# EAGLE schematic main (EAGLE 8.0.0), part 2 of 4
## Sheet 21 of 48: CLA_MULT 10-7
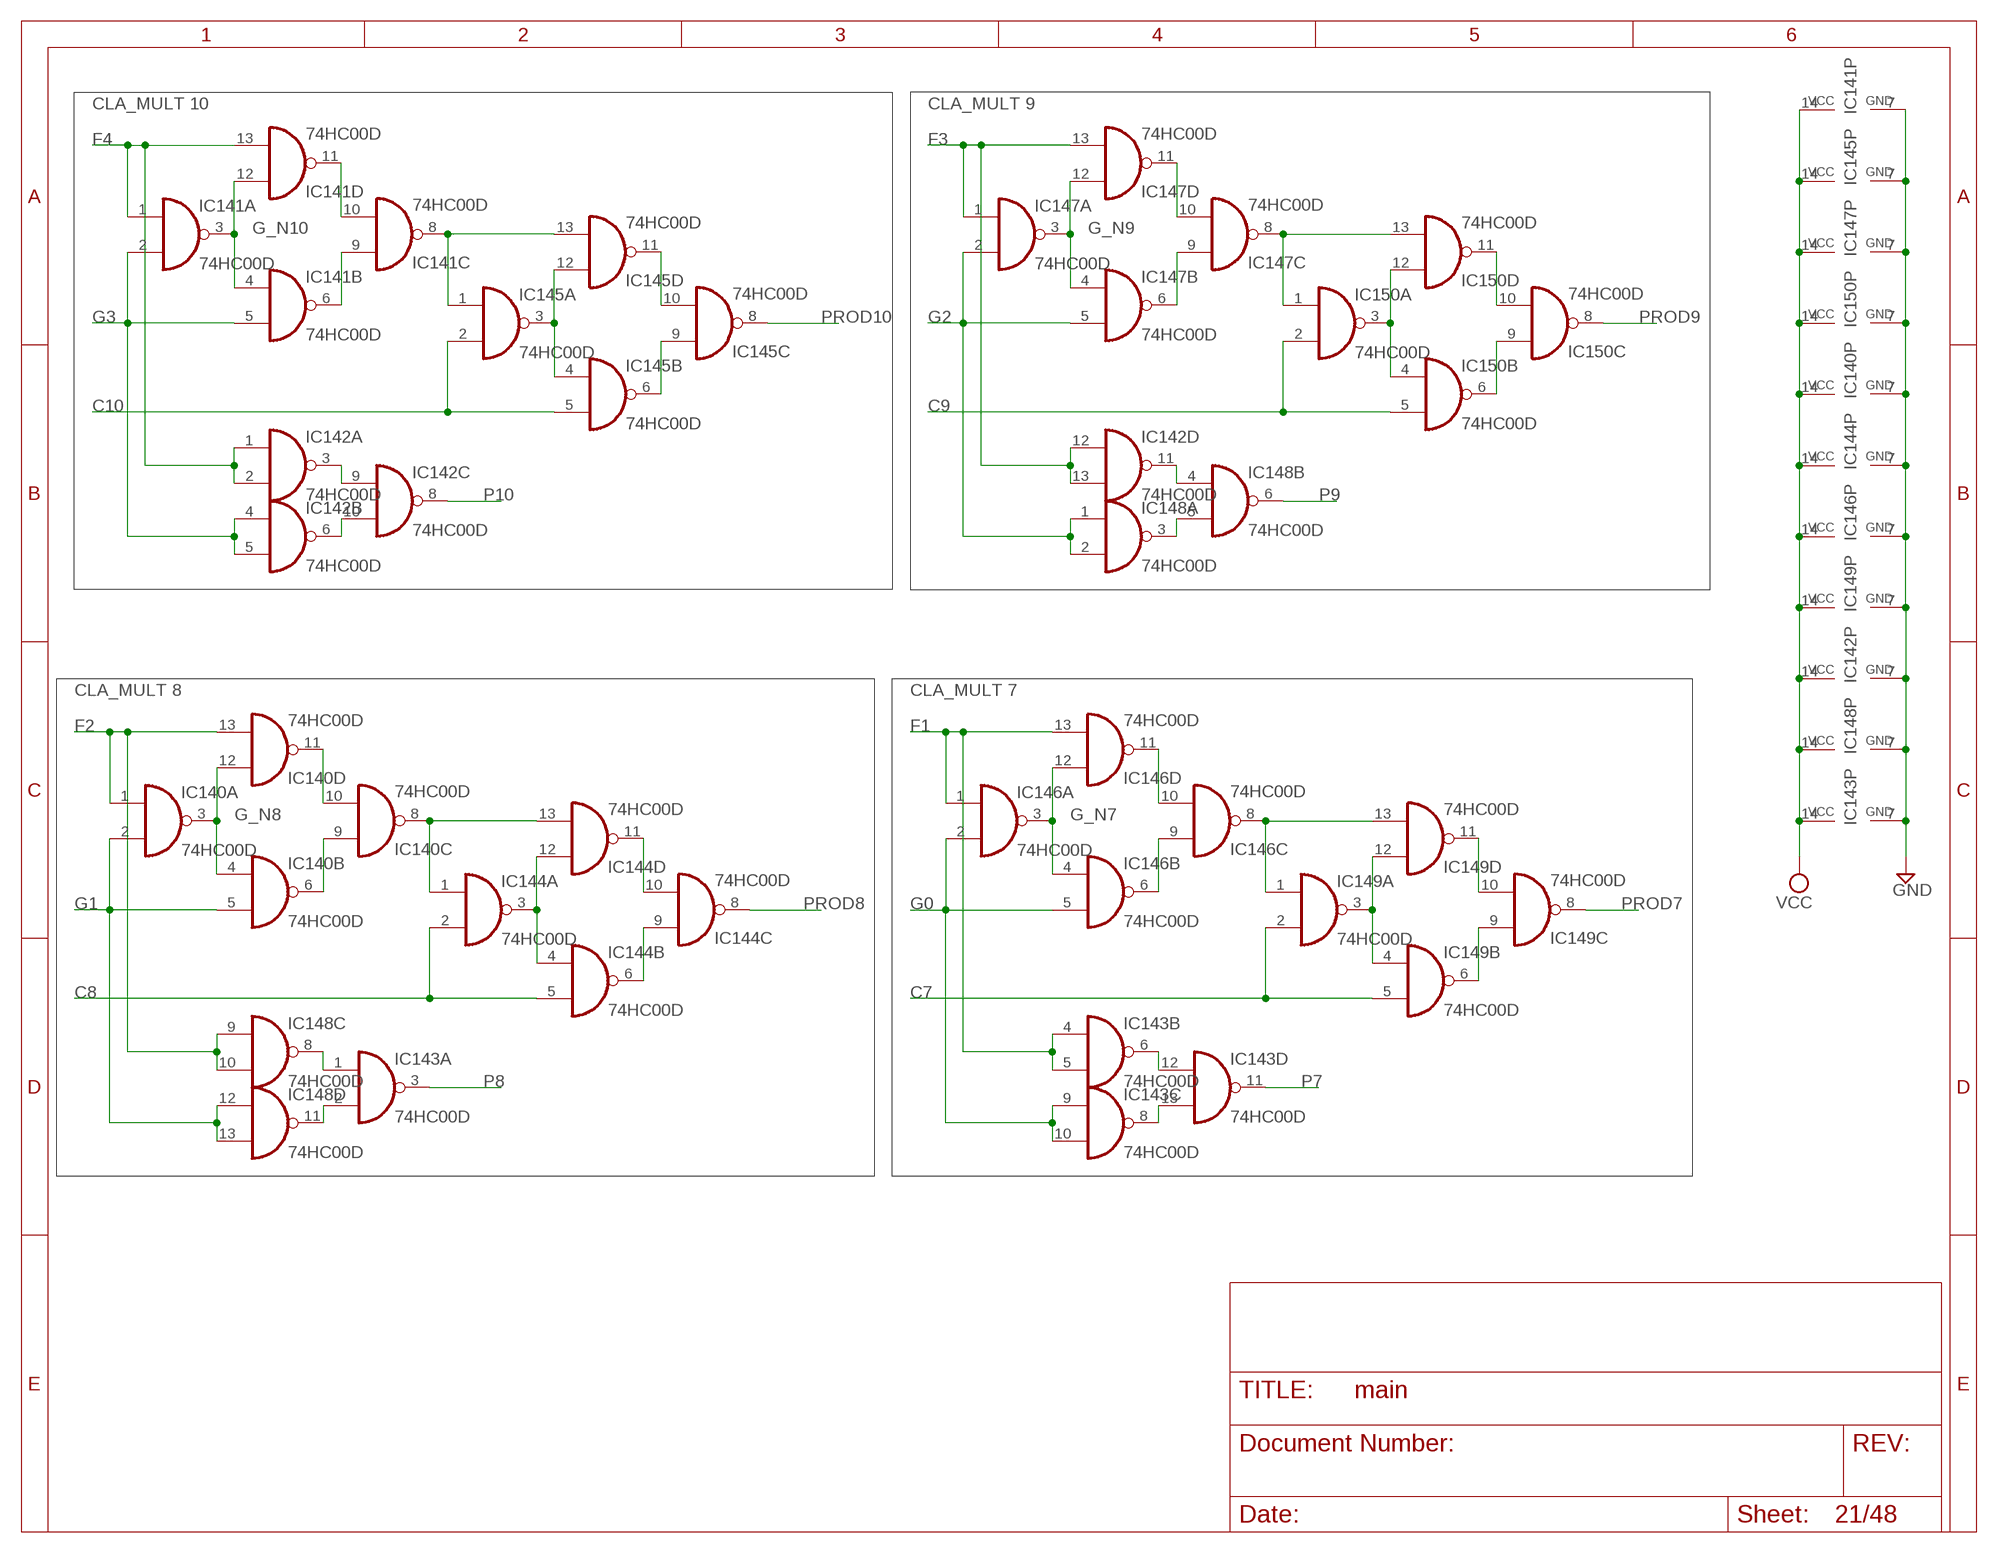
[diagram p20: schematic, sheet 21]

### Parts
IC140  74HC00D  [SO14]
IC141  74HC00D  [SO14]
IC142  74HC00D  [SO14]
IC143  74HC00D  [SO14]
IC144  74HC00D  [SO14]
IC145  74HC00D  [SO14]
IC146  74HC00D  [SO14]
IC147  74HC00D  [SO14]
IC148  74HC00D  [SO14]
IC149  74HC00D  [SO14]
IC150  74HC00D  [SO14]

### Nets
C7: IC149.2(A:I1) IC149.5(B:I1) ; also sheet 23
C8: IC144.2(A:I1) IC144.5(B:I1) ; also sheet 23
C9: IC150.2(A:I1) IC150.5(B:I1) ; also sheet 23
C10: IC145.2(A:I1) IC145.5(B:I1) ; also sheet 23
F1: IC143.4(B:I0) IC143.5(B:I1) IC146.1(A:I0) IC146.13(D:I1) ; also sheet 18
F2: IC140.1(A:I0) IC140.13(D:I1) IC148.9(C:I0) IC148.10(C:I1) ; also sheet 18
F3: IC142.12(D:I0) IC142.13(D:I1) IC147.1(A:I0) IC147.13(D:I1) ; also sheet 18
F4: IC141.1(A:I0) IC141.13(D:I1) IC142.1(A:I0) IC142.2(A:I1) ; also sheet 18
G0: IC143.9(C:I0) IC143.10(C:I1) IC146.2(A:I1) IC146.5(B:I1) ; also sheet 14
G1: IC140.2(A:I1) IC140.5(B:I1) IC148.12(D:I0) IC148.13(D:I1) ; also sheet 18
G2: IC147.2(A:I1) IC147.5(B:I1) IC148.1(A:I0) IC148.2(A:I1) ; also sheet 18
G3: IC141.2(A:I1) IC141.5(B:I1) IC142.4(B:I0) IC142.5(B:I1) ; also sheet 18
G_N7: IC146.3(A:O) IC146.4(B:I0) IC146.12(D:I0) ; also sheet 23
G_N8: IC140.3(A:O) IC140.4(B:I0) IC140.12(D:I0) ; also sheet 23
G_N9: IC147.3(A:O) IC147.4(B:I0) IC147.12(D:I0) ; also sheet 23
G_N10: IC141.3(A:O) IC141.4(B:I0) IC141.12(D:I0) ; also sheet 23
GND: IC140.7(P:GND) IC141.7(P:GND) IC142.7(P:GND) IC143.7(P:GND) IC144.7(P:GND) IC145.7(P:GND) IC146.7(P:GND) IC147.7(P:GND) IC148.7(P:GND) IC149.7(P:GND) IC150.7(P:GND) ; also sheet 1,2,3,4,5,6,7,8,9,10,11,12,13,14,15,16,17,18,19,20,22,23,24,25,26,27,28,29,30,31,32,33,34,37,38,39,40,41,42,43,44,45,46,47
N$387: IC145.6(B:O) IC145.9(C:I0)
N$388: IC145.10(C:I1) IC145.11(D:O)
N$391: IC145.3(A:O) IC145.4(B:I0) IC145.12(D:I0)
N$392: IC141.6(B:O) IC141.9(C:I0)
N$411: IC141.10(C:I1) IC141.11(D:O)
N$415: IC141.8(C:O) IC145.1(A:I0) IC145.13(D:I1)
N$416: IC147.10(C:I1) IC147.11(D:O)
N$417: IC147.6(B:O) IC147.9(C:I0)
N$418: IC147.8(C:O) IC150.1(A:I0) IC150.13(D:I1)
N$423: IC150.3(A:O) IC150.4(B:I0) IC150.12(D:I0)
N$426: IC150.6(B:O) IC150.9(C:I0)
N$427: IC150.10(C:I1) IC150.11(D:O)
N$428: IC144.3(A:O) IC144.4(B:I0) IC144.12(D:I0)
N$430: IC140.8(C:O) IC144.1(A:I0) IC144.13(D:I1)
N$436: IC144.10(C:I1) IC144.11(D:O)
N$437: IC144.6(B:O) IC144.9(C:I0)
N$438: IC140.10(C:I1) IC140.11(D:O)
N$439: IC140.6(B:O) IC140.9(C:I0)
N$442: IC146.6(B:O) IC146.9(C:I0)
N$443: IC146.10(C:I1) IC146.11(D:O)
N$447: IC146.8(C:O) IC149.1(A:I0) IC149.13(D:I1)
N$450: IC149.3(A:O) IC149.4(B:I0) IC149.12(D:I0)
N$451: IC149.6(B:O) IC149.9(C:I0)
N$452: IC149.10(C:I1) IC149.11(D:O)
N$454: IC142.3(A:O) IC142.9(C:I0)
N$455: IC142.6(B:O) IC142.10(C:I1)
N$456: IC148.3(A:O) IC148.5(B:I1)
N$459: IC142.11(D:O) IC148.4(B:I0)
N$460: IC143.2(A:I1) IC148.11(D:O)
N$463: IC143.1(A:I0) IC148.8(C:O)
N$464: IC143.8(C:O) IC143.13(D:I1)
N$465: IC143.6(B:O) IC143.12(D:I0)
P7: IC143.11(D:O) ; also sheet 23
P8: IC143.3(A:O) ; also sheet 23
P9: IC148.6(B:O) ; also sheet 23
P10: IC142.8(C:O) ; also sheet 23
PROD7: IC149.8(C:O) ; also sheet 44
PROD8: IC144.8(C:O)
PROD9: IC150.8(C:O)
PROD10: IC145.8(C:O)
VCC: IC140.14(P:VCC) IC141.14(P:VCC) IC142.14(P:VCC) IC143.14(P:VCC) IC144.14(P:VCC) IC145.14(P:VCC) IC146.14(P:VCC) IC147.14(P:VCC) IC148.14(P:VCC) IC149.14(P:VCC) IC150.14(P:VCC) ; also sheet 1,2,3,4,5,6,7,8,9,10,11,12,13,14,15,16,17,18,19,20,22,23,24,25,26,27,28,29,30,31,32,33,34,37,38,39,40,41,42,43,44,45,46,47

### Notes on the sheet
- CLA_MULT 10 | CLA_MULT 9
- CLA_MULT 8 | CLA_MULT 7

## Sheet 22 of 48: CLA_MULT 5-2
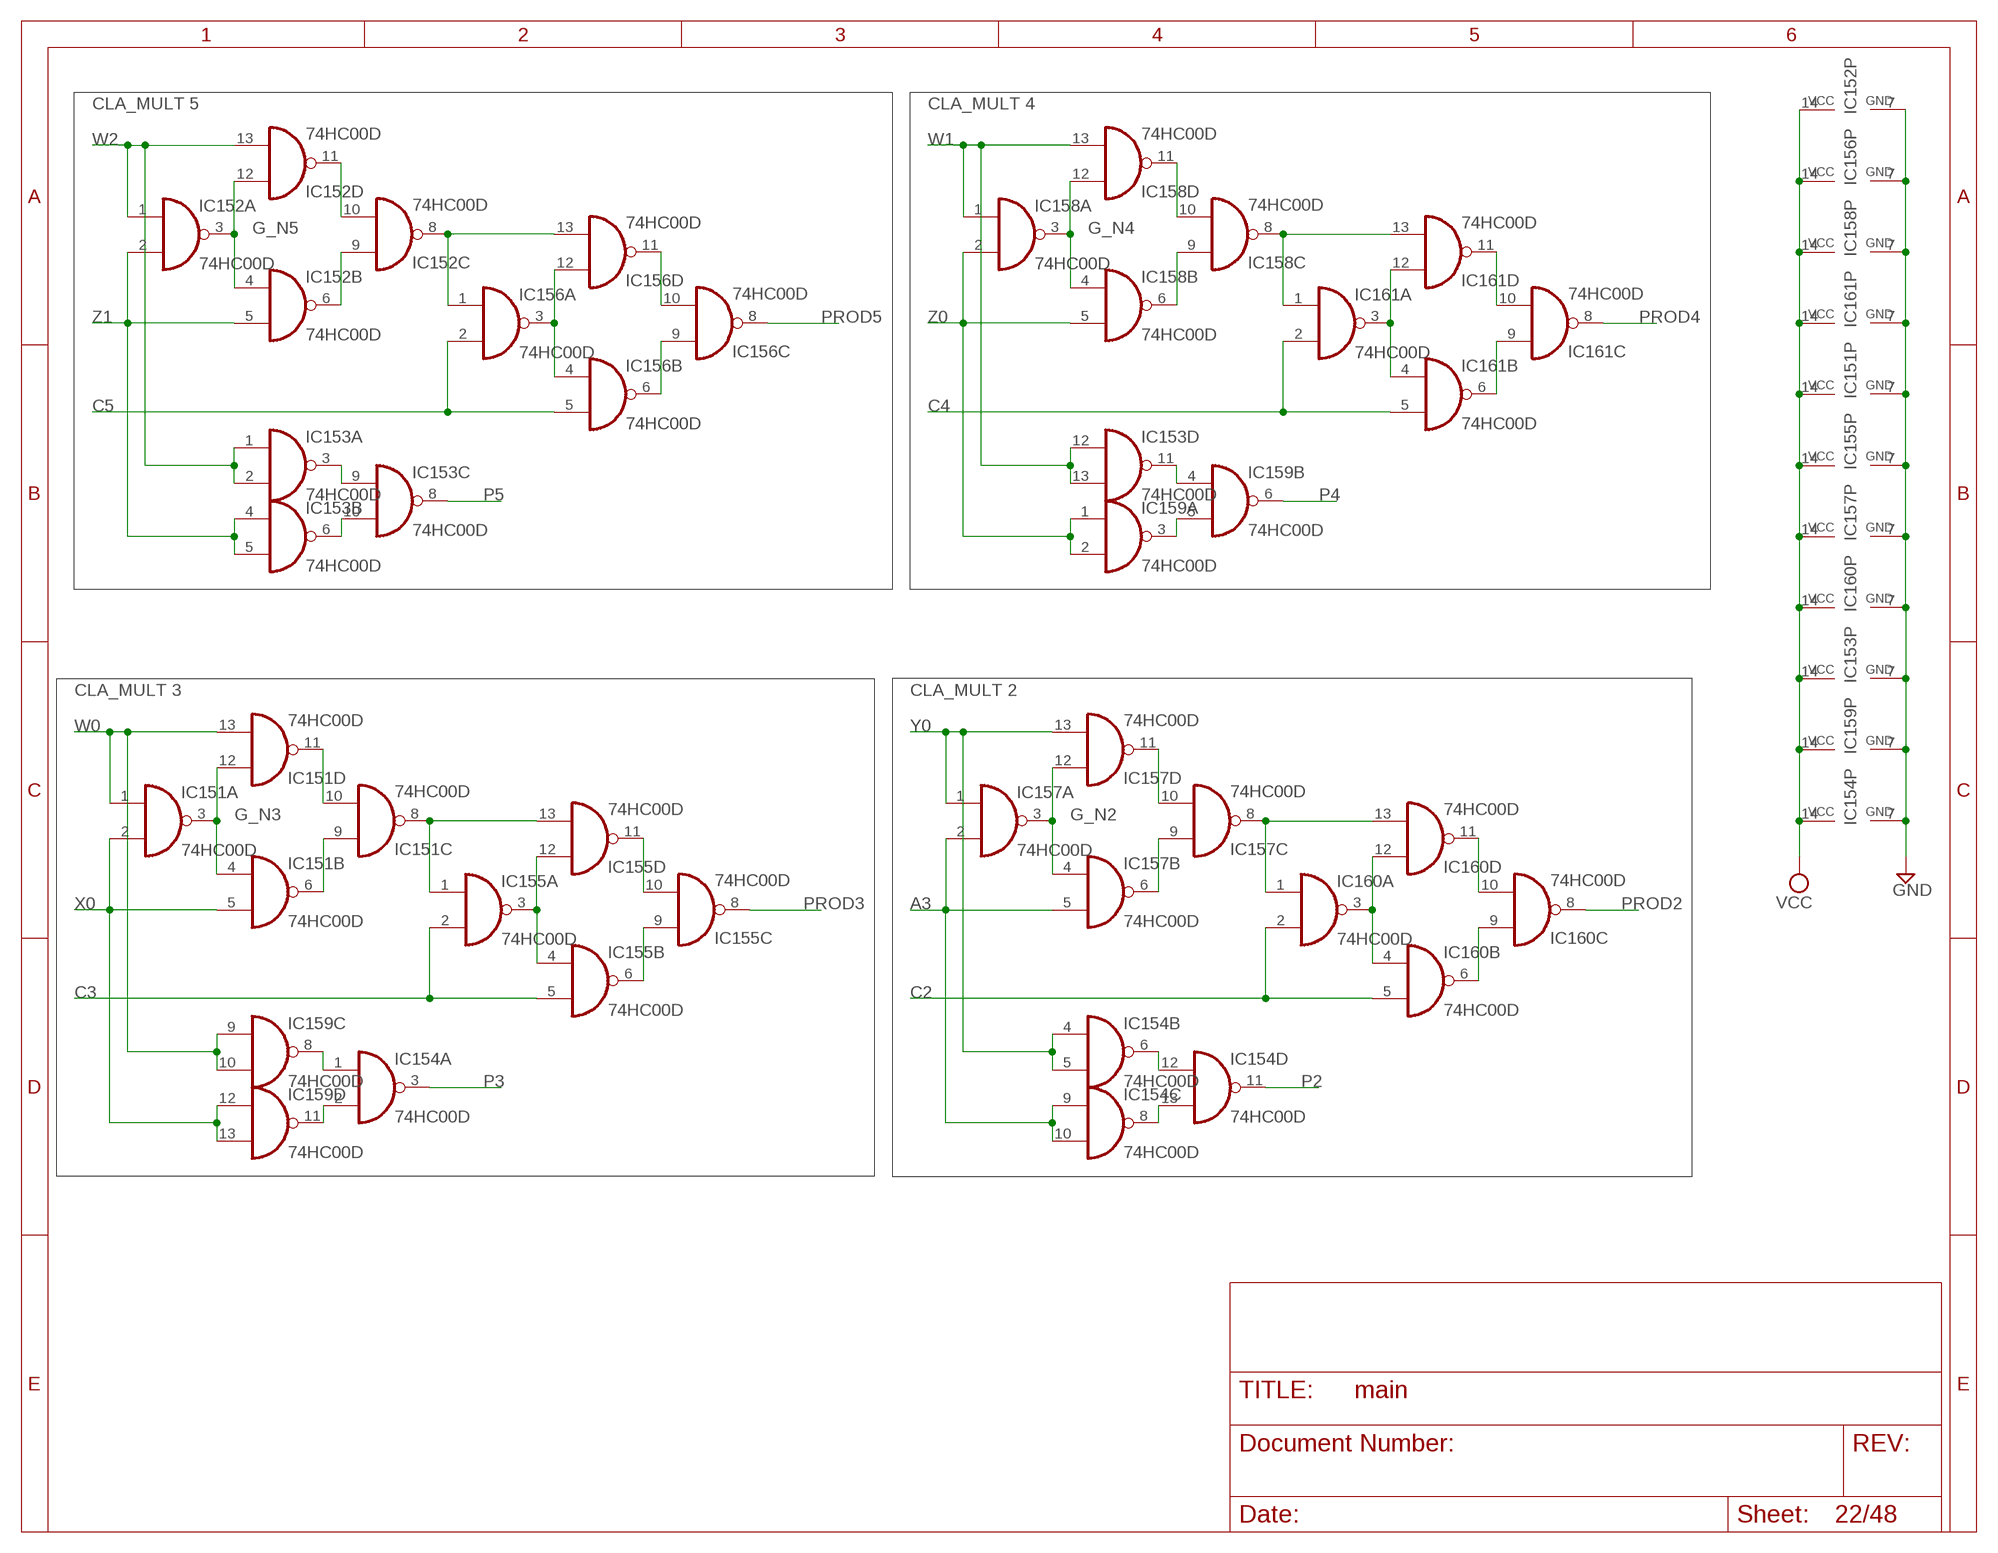
[diagram p21: schematic, sheet 22]

### Parts
IC151  74HC00D  [SO14]
IC152  74HC00D  [SO14]
IC153  74HC00D  [SO14]
IC154  74HC00D  [SO14]
IC155  74HC00D  [SO14]
IC156  74HC00D  [SO14]
IC157  74HC00D  [SO14]
IC158  74HC00D  [SO14]
IC159  74HC00D  [SO14]
IC160  74HC00D  [SO14]
IC161  74HC00D  [SO14]

### Nets
A3: IC154.9(C:I0) IC154.10(C:I1) IC157.2(A:I1) IC157.5(B:I1) ; also sheet 1,2,5,6,11,24,25,26,30,34,41
C2: IC160.2(A:I1) IC160.5(B:I1) ; also sheet 23
C3: IC155.2(A:I1) IC155.5(B:I1) ; also sheet 23
C4: IC161.2(A:I1) IC161.5(B:I1) ; also sheet 23
C5: IC156.2(A:I1) IC156.5(B:I1) ; also sheet 23
G_N2: IC157.3(A:O) IC157.4(B:I0) IC157.12(D:I0) ; also sheet 23
G_N3: IC151.3(A:O) IC151.4(B:I0) IC151.12(D:I0) ; also sheet 23
G_N4: IC158.3(A:O) IC158.4(B:I0) IC158.12(D:I0) ; also sheet 23
G_N5: IC152.3(A:O) IC152.4(B:I0) IC152.12(D:I0) ; also sheet 23
GND: IC151.7(P:GND) IC152.7(P:GND) IC153.7(P:GND) IC154.7(P:GND) IC155.7(P:GND) IC156.7(P:GND) IC157.7(P:GND) IC158.7(P:GND) IC159.7(P:GND) IC160.7(P:GND) IC161.7(P:GND) ; also sheet 1,2,3,4,5,6,7,8,9,10,11,12,13,14,15,16,17,18,19,20,21,23,24,25,26,27,28,29,30,31,32,33,34,37,38,39,40,41,42,43,44,45,46,47
N$466: IC156.6(B:O) IC156.9(C:I0)
N$469: IC156.10(C:I1) IC156.11(D:O)
N$470: IC156.3(A:O) IC156.4(B:I0) IC156.12(D:I0)
N$471: IC152.8(C:O) IC156.1(A:I0) IC156.13(D:I1)
N$472: IC152.6(B:O) IC152.9(C:I0)
N$473: IC152.10(C:I1) IC152.11(D:O)
N$474: IC158.10(C:I1) IC158.11(D:O)
N$475: IC158.6(B:O) IC158.9(C:I0)
N$476: IC158.8(C:O) IC161.1(A:I0) IC161.13(D:I1)
N$477: IC161.3(A:O) IC161.4(B:I0) IC161.12(D:I0)
N$478: IC161.6(B:O) IC161.9(C:I0)
N$479: IC161.10(C:I1) IC161.11(D:O)
N$480: IC155.3(A:O) IC155.4(B:I0) IC155.12(D:I0)
N$481: IC151.8(C:O) IC155.1(A:I0) IC155.13(D:I1)
N$482: IC155.10(C:I1) IC155.11(D:O)
N$483: IC155.6(B:O) IC155.9(C:I0)
N$484: IC151.10(C:I1) IC151.11(D:O)
N$485: IC151.6(B:O) IC151.9(C:I0)
N$486: IC157.6(B:O) IC157.9(C:I0)
N$487: IC157.10(C:I1) IC157.11(D:O)
N$488: IC157.8(C:O) IC160.1(A:I0) IC160.13(D:I1)
N$489: IC160.3(A:O) IC160.4(B:I0) IC160.12(D:I0)
N$490: IC160.6(B:O) IC160.9(C:I0)
N$491: IC160.10(C:I1) IC160.11(D:O)
N$492: IC153.3(A:O) IC153.9(C:I0)
N$493: IC153.6(B:O) IC153.10(C:I1)
N$494: IC159.3(A:O) IC159.5(B:I1)
N$495: IC153.11(D:O) IC159.4(B:I0)
N$496: IC154.2(A:I1) IC159.11(D:O)
N$497: IC154.1(A:I0) IC159.8(C:O)
N$498: IC154.8(C:O) IC154.13(D:I1)
N$499: IC154.6(B:O) IC154.12(D:I0)
P2: IC154.11(D:O) ; also sheet 23
P3: IC154.3(A:O) ; also sheet 23
P4: IC159.6(B:O) ; also sheet 23
P5: IC153.8(C:O) ; also sheet 23
PROD2: IC160.8(C:O) ; also sheet 45
PROD3: IC155.8(C:O) ; also sheet 45
PROD4: IC161.8(C:O) ; also sheet 44
PROD5: IC156.8(C:O) ; also sheet 44
VCC: IC151.14(P:VCC) IC152.14(P:VCC) IC153.14(P:VCC) IC154.14(P:VCC) IC155.14(P:VCC) IC156.14(P:VCC) IC157.14(P:VCC) IC158.14(P:VCC) IC159.14(P:VCC) IC160.14(P:VCC) IC161.14(P:VCC) ; also sheet 1,2,3,4,5,6,7,8,9,10,11,12,13,14,15,16,17,18,19,20,21,23,24,25,26,27,28,29,30,31,32,33,34,37,38,39,40,41,42,43,44,45,46,47
W0: IC151.1(A:I0) IC151.13(D:I1) IC159.9(C:I0) IC159.10(C:I1) ; also sheet 16
W1: IC153.12(D:I0) IC153.13(D:I1) IC158.1(A:I0) IC158.13(D:I1) ; also sheet 16
W2: IC152.1(A:I0) IC152.13(D:I1) IC153.1(A:I0) IC153.2(A:I1) ; also sheet 16
X0: IC151.2(A:I1) IC151.5(B:I1) IC159.12(D:I0) IC159.13(D:I1) ; also sheet 16
Y0: IC154.4(B:I0) IC154.5(B:I1) IC157.1(A:I0) IC157.13(D:I1) ; also sheet 16
Z0: IC158.2(A:I1) IC158.5(B:I1) IC159.1(A:I0) IC159.2(A:I1) ; also sheet 16
Z1: IC152.2(A:I1) IC152.5(B:I1) IC153.4(B:I0) IC153.5(B:I1) ; also sheet 16

### Notes on the sheet
- CLA_MULT 5 | CLA_MULT 4
- CLA_MULT 3 | CLA_MULT 2

## Sheet 23 of 48: CLA_MULT 15, CLU_MULT
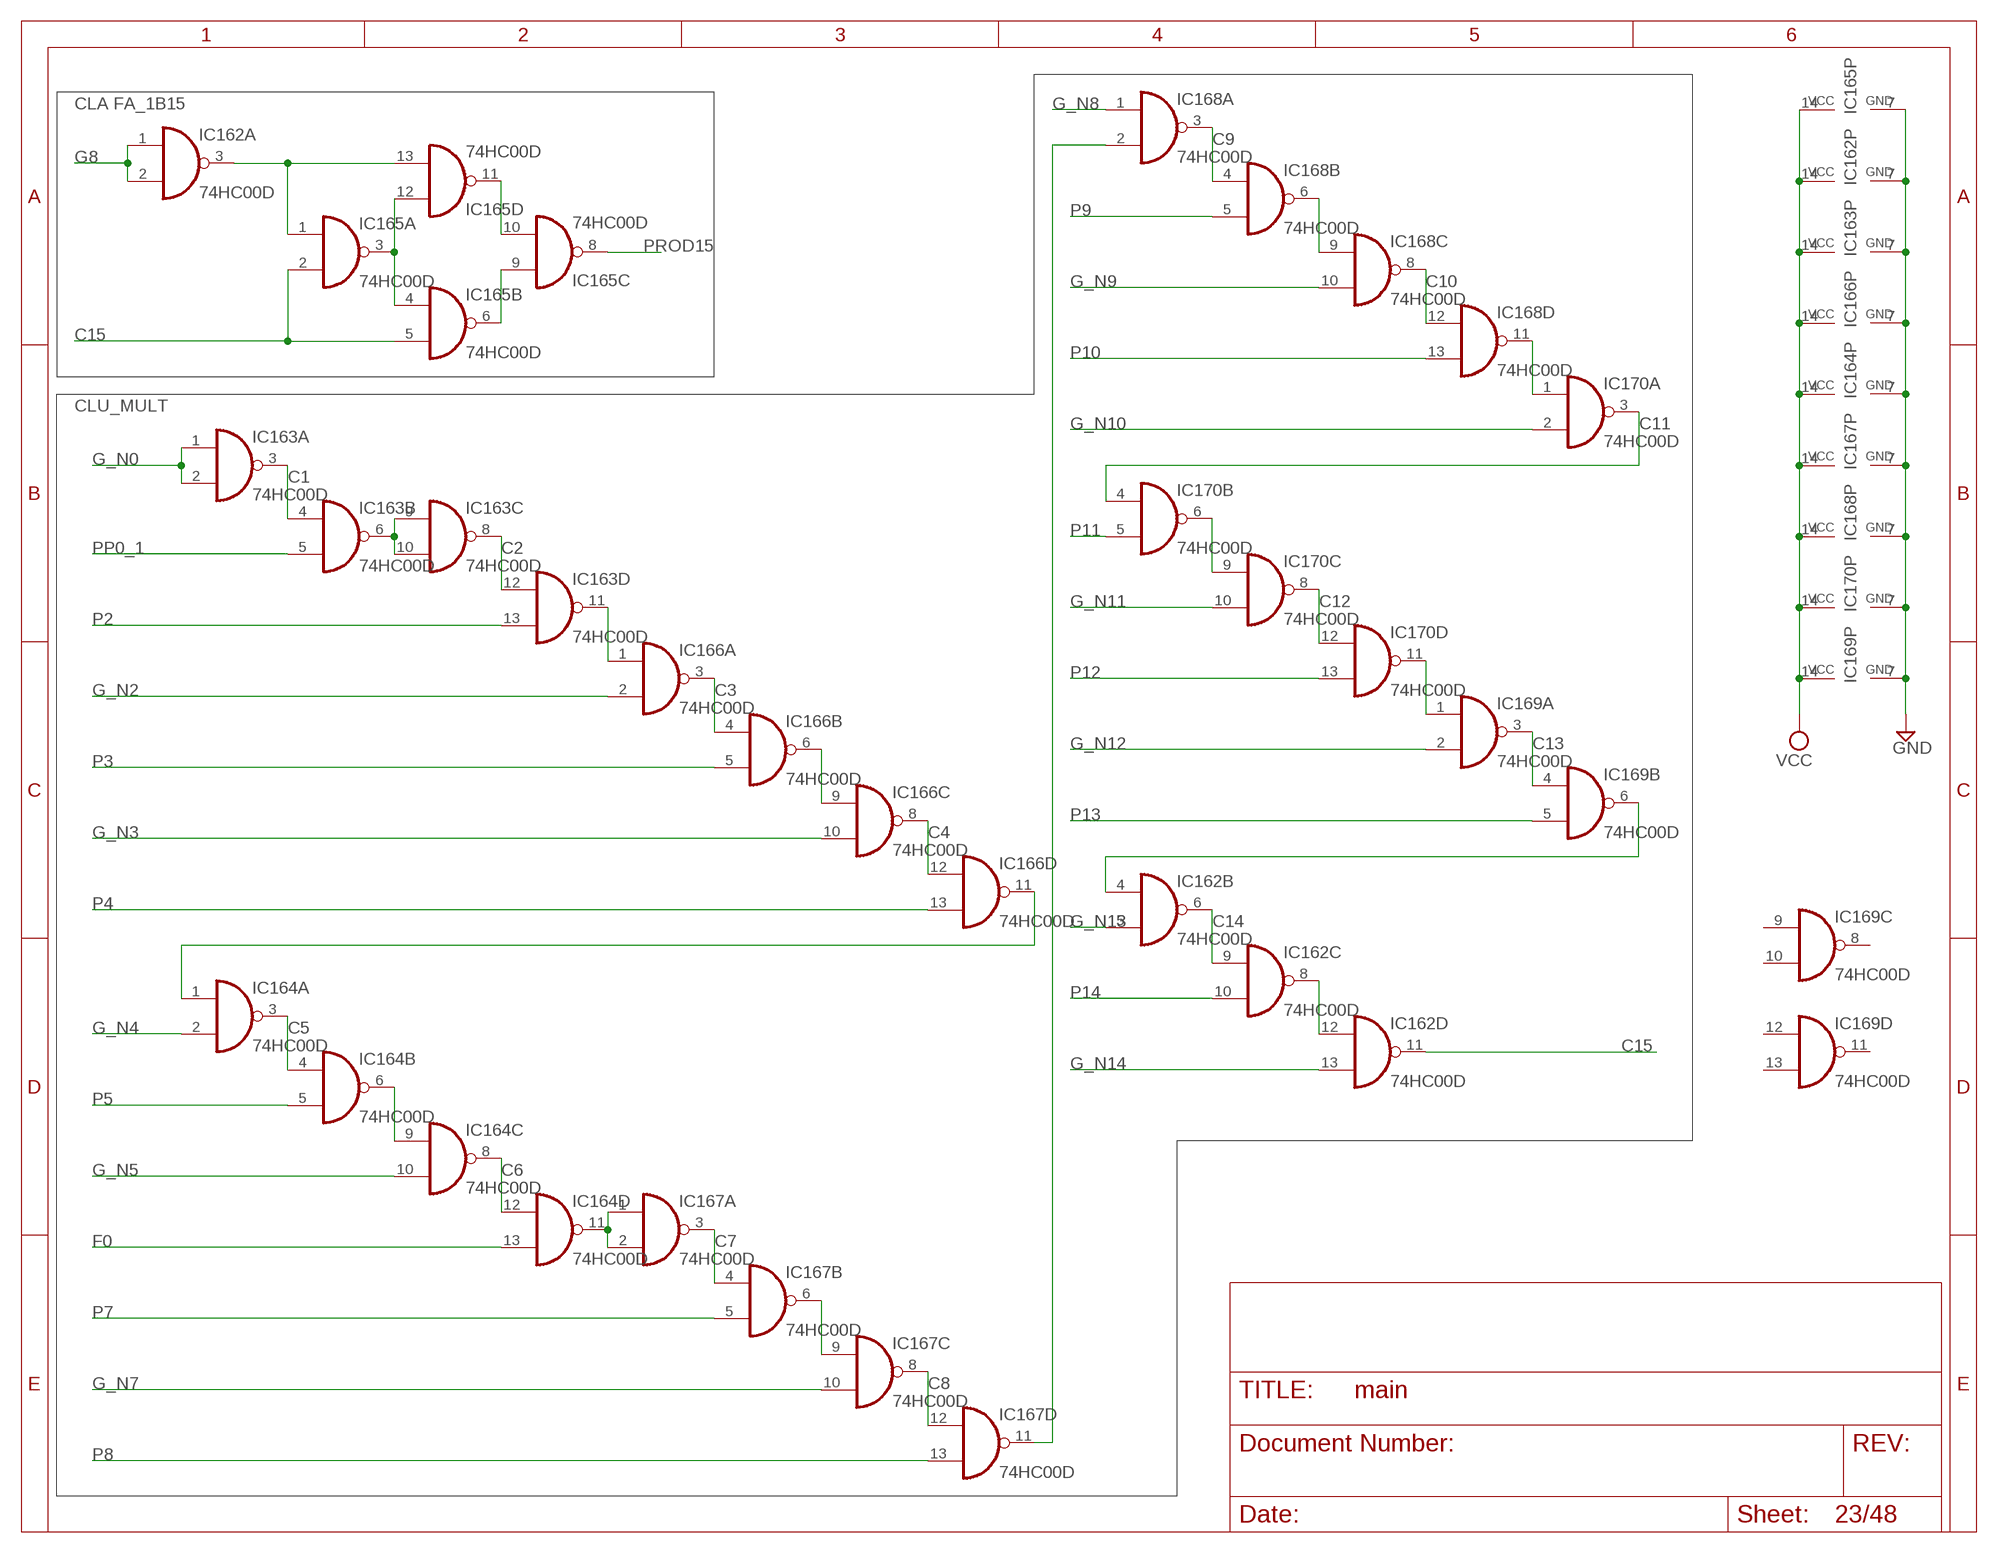
[diagram p22: schematic, sheet 23]

### Parts
IC162  74HC00D  [SO14]
IC163  74HC00D  [SO14]
IC164  74HC00D  [SO14]
IC165  74HC00D  [SO14]
IC166  74HC00D  [SO14]
IC167  74HC00D  [SO14]
IC168  74HC00D  [SO14]
IC169  74HC00D  [SO14]
IC170  74HC00D  [SO14]

### Nets
C1: IC163.3(A:O) IC163.4(B:I0) ; also sheet 19
C2: IC163.8(C:O) IC163.12(D:I0) ; also sheet 22
C3: IC166.3(A:O) IC166.4(B:I0) ; also sheet 22
C4: IC166.8(C:O) IC166.12(D:I0) ; also sheet 22
C5: IC164.3(A:O) IC164.4(B:I0) ; also sheet 22
C6: IC164.8(C:O) IC164.12(D:I0) ; also sheet 19
C7: IC167.3(A:O) IC167.4(B:I0) ; also sheet 21
C8: IC167.8(C:O) IC167.12(D:I0) ; also sheet 21
C9: IC168.3(A:O) IC168.4(B:I0) ; also sheet 21
C10: IC168.8(C:O) IC168.12(D:I0) ; also sheet 21
C11: IC170.3(A:O) IC170.4(B:I0) ; also sheet 20
C12: IC170.8(C:O) IC170.12(D:I0) ; also sheet 20
C13: IC169.3(A:O) IC169.4(B:I0) ; also sheet 20
C14: IC162.6(B:O) IC162.9(C:I0) ; also sheet 20
C15: IC162.11(D:O) IC165.2(A:I1) IC165.5(B:I1)
F0: IC164.13(D:I1) ; also sheet 14,19
G8: IC162.1(A:I0) IC162.2(A:I1) ; also sheet 17
G_N0: IC163.1(A:I0) IC163.2(A:I1) ; also sheet 19
G_N2: IC166.2(A:I1) ; also sheet 22
G_N3: IC166.10(C:I1) ; also sheet 22
G_N4: IC164.2(A:I1) ; also sheet 22
G_N5: IC164.10(C:I1) ; also sheet 22
G_N7: IC167.10(C:I1) ; also sheet 21
G_N8: IC168.1(A:I0) ; also sheet 21
G_N9: IC168.10(C:I1) ; also sheet 21
G_N10: IC170.2(A:I1) ; also sheet 21
G_N11: IC170.10(C:I1) ; also sheet 20
G_N12: IC169.2(A:I1) ; also sheet 20
G_N13: IC162.5(B:I1) ; also sheet 20
G_N14: IC162.13(D:I1) ; also sheet 20
GND: IC162.7(P:GND) IC163.7(P:GND) IC164.7(P:GND) IC165.7(P:GND) IC166.7(P:GND) IC167.7(P:GND) IC168.7(P:GND) IC169.7(P:GND) IC170.7(P:GND) ; also sheet 1,2,3,4,5,6,7,8,9,10,11,12,13,14,15,16,17,18,19,20,21,22,24,25,26,27,28,29,30,31,32,33,34,37,38,39,40,41,42,43,44,45,46,47
N$500: IC162.3(A:O) IC165.1(A:I0) IC165.13(D:I1)
N$501: IC165.3(A:O) IC165.4(B:I0) IC165.12(D:I0)
N$502: IC164.1(A:I0) IC166.11(D:O)
N$504: IC165.6(B:O) IC165.9(C:I0)
N$505: IC165.10(C:I1) IC165.11(D:O)
N$506: IC163.6(B:O) IC163.9(C:I0) IC163.10(C:I1)
N$508: IC163.11(D:O) IC166.1(A:I0)
N$510: IC166.6(B:O) IC166.9(C:I0)
N$512: IC164.11(D:O) IC167.1(A:I0) IC167.2(A:I1)
N$515: IC164.6(B:O) IC164.9(C:I0)
N$517: IC167.6(B:O) IC167.9(C:I0)
N$519: IC167.11(D:O) IC168.2(A:I1)
N$521: IC168.6(B:O) IC168.9(C:I0)
N$523: IC168.11(D:O) IC170.1(A:I0)
N$525: IC170.6(B:O) IC170.9(C:I0)
N$527: IC169.1(A:I0) IC170.11(D:O)
N$528: IC162.4(B:I0) IC169.6(B:O)
N$532: IC162.8(C:O) IC162.12(D:I0)
P2: IC163.13(D:I1) ; also sheet 22
P3: IC166.5(B:I1) ; also sheet 22
P4: IC166.13(D:I1) ; also sheet 22
P5: IC164.5(B:I1) ; also sheet 22
P7: IC167.5(B:I1) ; also sheet 21
P8: IC167.13(D:I1) ; also sheet 21
P9: IC168.5(B:I1) ; also sheet 21
P10: IC168.13(D:I1) ; also sheet 21
P11: IC170.5(B:I1) ; also sheet 20
P12: IC170.13(D:I1) ; also sheet 20
P13: IC169.5(B:I1) ; also sheet 20
P14: IC162.10(C:I1) ; also sheet 20
PP0_1: IC163.5(B:I1) ; also sheet 4,19
PROD15: IC165.8(C:O)
VCC: IC162.14(P:VCC) IC163.14(P:VCC) IC164.14(P:VCC) IC165.14(P:VCC) IC166.14(P:VCC) IC167.14(P:VCC) IC168.14(P:VCC) IC169.14(P:VCC) IC170.14(P:VCC) ; also sheet 1,2,3,4,5,6,7,8,9,10,11,12,13,14,15,16,17,18,19,20,21,22,24,25,26,27,28,29,30,31,32,33,34,37,38,39,40,41,42,43,44,45,46,47
Unconnected: IC169.8(C:O) IC169.9(C:I0) IC169.10(C:I1) IC169.11(D:O) IC169.12(D:I0) IC169.13(D:I1)

### Notes on the sheet
- CLA FA_1B15
- CLU_MULT

## Sheet 24 of 48: AND, NOT, OR ADDCARD
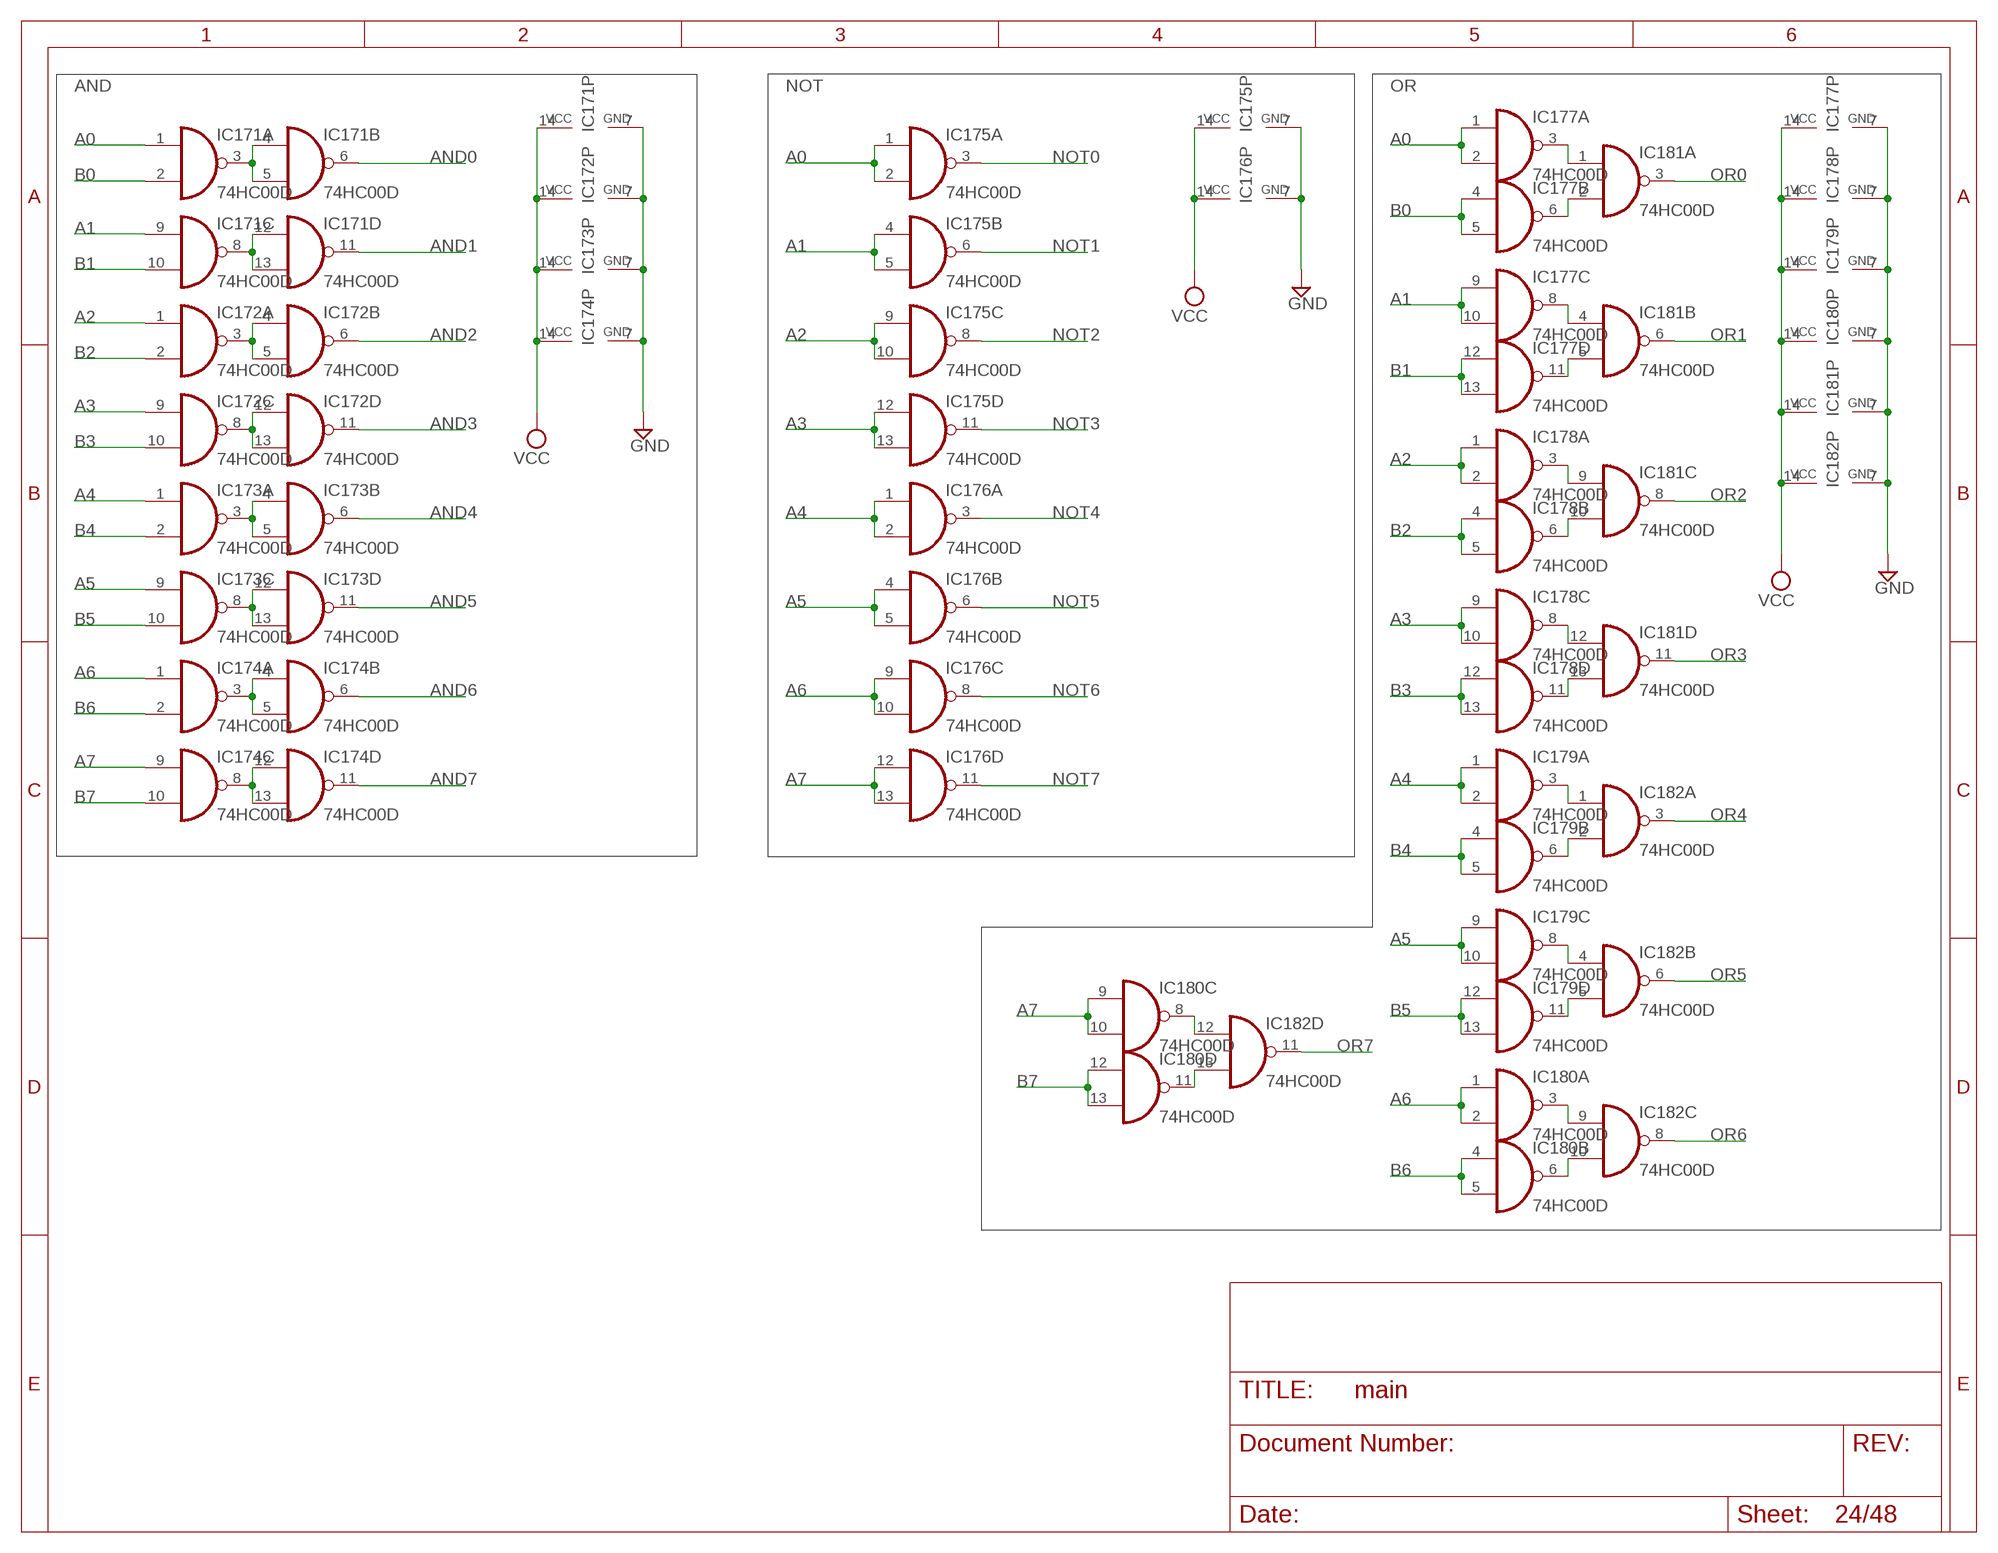
[diagram p23: schematic, sheet 24]

### Parts
IC171  74HC00D  [SO14]
IC172  74HC00D  [SO14]
IC173  74HC00D  [SO14]
IC174  74HC00D  [SO14]
IC175  74HC00D  [SO14]
IC176  74HC00D  [SO14]
IC177  74HC00D  [SO14]
IC178  74HC00D  [SO14]
IC179  74HC00D  [SO14]
IC180  74HC00D  [SO14]
IC181  74HC00D  [SO14]
IC182  74HC00D  [SO14]

### Nets
A0: IC171.1(A:I0) IC175.1(A:I0) IC175.2(A:I1) IC177.1(A:I0) IC177.2(A:I1) ; also sheet 1,3,4,11,25,26,30,34,41
A1: IC171.9(C:I0) IC175.4(B:I0) IC175.5(B:I1) IC177.9(C:I0) IC177.10(C:I1) ; also sheet 1,3,4,11,19,25,26,30,34,41
A2: IC172.1(A:I0) IC175.9(C:I0) IC175.10(C:I1) IC178.1(A:I0) IC178.2(A:I1) ; also sheet 1,25,26,30,34,41
A3: IC172.9(C:I0) IC175.12(D:I0) IC175.13(D:I1) IC178.9(C:I0) IC178.10(C:I1) ; also sheet 1,2,5,6,11,22,25,26,30,34,41
A4: IC173.1(A:I0) IC176.1(A:I0) IC176.2(A:I1) IC179.1(A:I0) IC179.2(A:I1) ; also sheet 2,25,27,30,34,40
A5: IC173.9(C:I0) IC176.4(B:I0) IC176.5(B:I1) IC179.9(C:I0) IC179.10(C:I1) ; also sheet 2,7,8,11,16,25,27,30,34,40
A6: IC174.1(A:I0) IC176.9(C:I0) IC176.10(C:I1) IC180.1(A:I0) IC180.2(A:I1) ; also sheet 2,25,27,30,34,40
A7: IC174.9(C:I0) IC176.12(D:I0) IC176.13(D:I1) IC180.9(C:I0) IC180.10(C:I1) ; also sheet 2,9,10,11,15,25,27,30,34,40
AND0: IC171.6(B:O) ; also sheet 45
AND1: IC171.11(D:O) ; also sheet 45
AND2: IC172.6(B:O) ; also sheet 45
AND3: IC172.11(D:O) ; also sheet 45
AND4: IC173.6(B:O) ; also sheet 44
AND5: IC173.11(D:O) ; also sheet 44
AND6: IC174.6(B:O) ; also sheet 44
AND7: IC174.11(D:O) ; also sheet 44
B0: IC171.2(A:I1) IC177.4(B:I0) IC177.5(B:I1) ; also sheet 4,6,8,10,11,25,26,34,43
B1: IC171.10(C:I1) IC177.12(D:I0) IC177.13(D:I1) ; also sheet 4,6,8,10,25,26,34,43
B2: IC172.2(A:I1) IC178.4(B:I0) IC178.5(B:I1) ; also sheet 4,6,8,10,25,26,34,43
B3: IC172.10(C:I1) IC178.12(D:I0) IC178.13(D:I1) ; also sheet 4,6,8,10,25,26,34,43
B4: IC173.2(A:I1) IC179.4(B:I0) IC179.5(B:I1) ; also sheet 3,4,5,6,7,8,9,10,25,27,34,42
B5: IC173.10(C:I1) IC179.12(D:I0) IC179.13(D:I1) ; also sheet 3,5,7,9,25,27,34,42
B6: IC174.2(A:I1) IC180.4(B:I0) IC180.5(B:I1) ; also sheet 3,5,7,9,25,27,34,42
B7: IC174.10(C:I1) IC180.12(D:I0) IC180.13(D:I1) ; also sheet 3,5,7,9,25,27,34,42
GND: IC171.7(P:GND) IC172.7(P:GND) IC173.7(P:GND) IC174.7(P:GND) IC175.7(P:GND) IC176.7(P:GND) IC177.7(P:GND) IC178.7(P:GND) IC179.7(P:GND) IC180.7(P:GND) IC181.7(P:GND) IC182.7(P:GND) ; also sheet 1,2,3,4,5,6,7,8,9,10,11,12,13,14,15,16,17,18,19,20,21,22,23,25,26,27,28,29,30,31,32,33,34,37,38,39,40,41,42,43,44,45,46,47
N$509: IC171.3(A:O) IC171.4(B:I0) IC171.5(B:I1)
N$511: IC171.8(C:O) IC171.12(D:I0) IC171.13(D:I1)
N$513: IC172.3(A:O) IC172.4(B:I0) IC172.5(B:I1)
N$514: IC172.8(C:O) IC172.12(D:I0) IC172.13(D:I1)
N$516: IC173.3(A:O) IC173.4(B:I0) IC173.5(B:I1)
N$518: IC173.8(C:O) IC173.12(D:I0) IC173.13(D:I1)
N$520: IC174.3(A:O) IC174.4(B:I0) IC174.5(B:I1)
N$522: IC174.8(C:O) IC174.12(D:I0) IC174.13(D:I1)
N$524: IC177.3(A:O) IC181.1(A:I0)
N$526: IC177.6(B:O) IC181.2(A:I1)
N$529: IC177.8(C:O) IC181.4(B:I0)
N$530: IC177.11(D:O) IC181.5(B:I1)
N$531: IC178.3(A:O) IC181.9(C:I0)
N$533: IC178.6(B:O) IC181.10(C:I1)
N$534: IC178.8(C:O) IC181.12(D:I0)
N$535: IC178.11(D:O) IC181.13(D:I1)
N$536: IC179.3(A:O) IC182.1(A:I0)
N$537: IC179.6(B:O) IC182.2(A:I1)
N$538: IC179.8(C:O) IC182.4(B:I0)
N$539: IC179.11(D:O) IC182.5(B:I1)
N$540: IC180.3(A:O) IC182.9(C:I0)
N$541: IC180.6(B:O) IC182.10(C:I1)
N$542: IC180.8(C:O) IC182.12(D:I0)
N$543: IC180.11(D:O) IC182.13(D:I1)
NOT0: IC175.3(A:O) ; also sheet 45
NOT1: IC175.6(B:O) ; also sheet 45
NOT2: IC175.8(C:O) ; also sheet 45
NOT3: IC175.11(D:O) ; also sheet 45
NOT4: IC176.3(A:O) ; also sheet 44
NOT5: IC176.6(B:O) ; also sheet 44
NOT6: IC176.8(C:O) ; also sheet 44
NOT7: IC176.11(D:O) ; also sheet 44
OR0: IC181.3(A:O) ; also sheet 45
OR1: IC181.6(B:O) ; also sheet 45
OR2: IC181.8(C:O) ; also sheet 45
OR3: IC181.11(D:O) ; also sheet 45
OR4: IC182.3(A:O) ; also sheet 44
OR5: IC182.6(B:O) ; also sheet 44
OR6: IC182.8(C:O) ; also sheet 44
OR7: IC182.11(D:O) ; also sheet 44
VCC: IC171.14(P:VCC) IC172.14(P:VCC) IC173.14(P:VCC) IC174.14(P:VCC) IC175.14(P:VCC) IC176.14(P:VCC) IC177.14(P:VCC) IC178.14(P:VCC) IC179.14(P:VCC) IC180.14(P:VCC) IC181.14(P:VCC) IC182.14(P:VCC) ; also sheet 1,2,3,4,5,6,7,8,9,10,11,12,13,14,15,16,17,18,19,20,21,22,23,25,26,27,28,29,30,31,32,33,34,37,38,39,40,41,42,43,44,45,46,47

### Notes on the sheet
- AND | NOT | OR

## Sheet 25 of 48: XOR
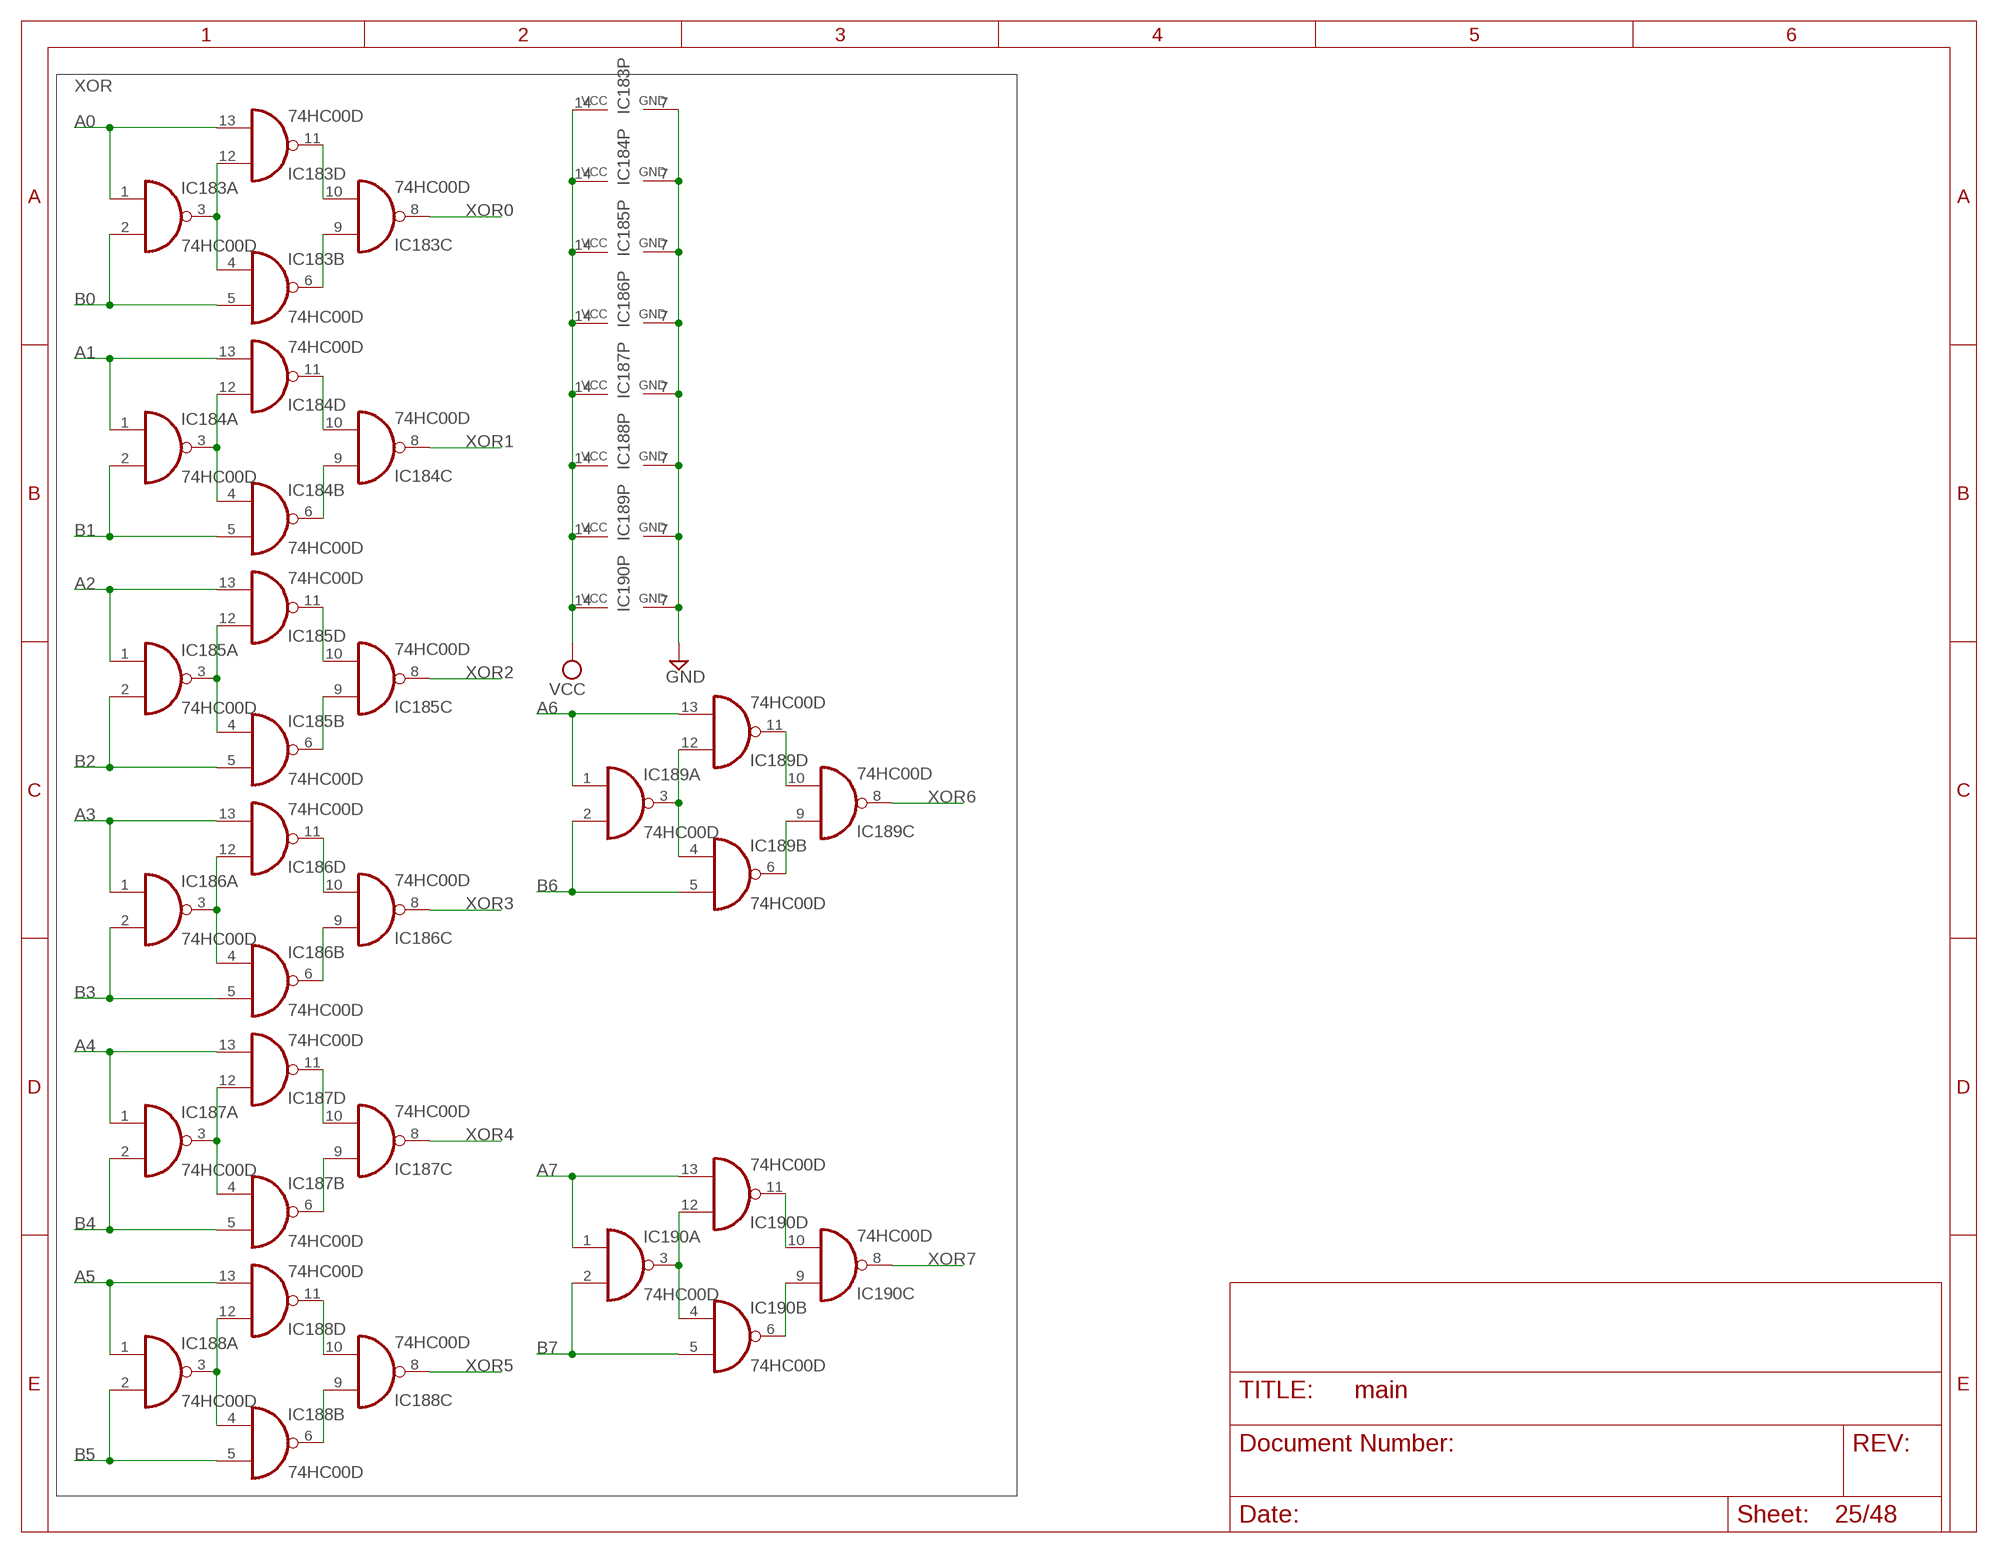
[diagram p24: schematic, sheet 25]

### Parts
IC183  74HC00D  [SO14]
IC184  74HC00D  [SO14]
IC185  74HC00D  [SO14]
IC186  74HC00D  [SO14]
IC187  74HC00D  [SO14]
IC188  74HC00D  [SO14]
IC189  74HC00D  [SO14]
IC190  74HC00D  [SO14]

### Nets
A0: IC183.1(A:I0) IC183.13(D:I1) ; also sheet 1,3,4,11,24,26,30,34,41
A1: IC184.1(A:I0) IC184.13(D:I1) ; also sheet 1,3,4,11,19,24,26,30,34,41
A2: IC185.1(A:I0) IC185.13(D:I1) ; also sheet 1,24,26,30,34,41
A3: IC186.1(A:I0) IC186.13(D:I1) ; also sheet 1,2,5,6,11,22,24,26,30,34,41
A4: IC187.1(A:I0) IC187.13(D:I1) ; also sheet 2,24,27,30,34,40
A5: IC188.1(A:I0) IC188.13(D:I1) ; also sheet 2,7,8,11,16,24,27,30,34,40
A6: IC189.1(A:I0) IC189.13(D:I1) ; also sheet 2,24,27,30,34,40
A7: IC190.1(A:I0) IC190.13(D:I1) ; also sheet 2,9,10,11,15,24,27,30,34,40
B0: IC183.2(A:I1) IC183.5(B:I1) ; also sheet 4,6,8,10,11,24,26,34,43
B1: IC184.2(A:I1) IC184.5(B:I1) ; also sheet 4,6,8,10,24,26,34,43
B2: IC185.2(A:I1) IC185.5(B:I1) ; also sheet 4,6,8,10,24,26,34,43
B3: IC186.2(A:I1) IC186.5(B:I1) ; also sheet 4,6,8,10,24,26,34,43
B4: IC187.2(A:I1) IC187.5(B:I1) ; also sheet 3,4,5,6,7,8,9,10,24,27,34,42
B5: IC188.2(A:I1) IC188.5(B:I1) ; also sheet 3,5,7,9,24,27,34,42
B6: IC189.2(A:I1) IC189.5(B:I1) ; also sheet 3,5,7,9,24,27,34,42
B7: IC190.2(A:I1) IC190.5(B:I1) ; also sheet 3,5,7,9,24,27,34,42
GND: IC183.7(P:GND) IC184.7(P:GND) IC185.7(P:GND) IC186.7(P:GND) IC187.7(P:GND) IC188.7(P:GND) IC189.7(P:GND) IC190.7(P:GND) ; also sheet 1,2,3,4,5,6,7,8,9,10,11,12,13,14,15,16,17,18,19,20,21,22,23,24,26,27,28,29,30,31,32,33,34,37,38,39,40,41,42,43,44,45,46,47
N$544: IC186.6(B:O) IC186.9(C:I0)
N$545: IC186.10(C:I1) IC186.11(D:O)
N$550: IC189.3(A:O) IC189.4(B:I0) IC189.12(D:I0)
N$551: IC189.10(C:I1) IC189.11(D:O)
N$552: IC189.6(B:O) IC189.9(C:I0)
N$553: IC185.6(B:O) IC185.9(C:I0)
N$554: IC185.10(C:I1) IC185.11(D:O)
N$555: IC190.3(A:O) IC190.4(B:I0) IC190.12(D:I0)
N$556: IC190.6(B:O) IC190.9(C:I0)
N$557: IC190.10(C:I1) IC190.11(D:O)
N$558: IC188.10(C:I1) IC188.11(D:O)
N$559: IC188.6(B:O) IC188.9(C:I0)
N$560: IC188.3(A:O) IC188.4(B:I0) IC188.12(D:I0)
N$565: IC187.3(A:O) IC187.4(B:I0) IC187.12(D:I0)
N$566: IC187.6(B:O) IC187.9(C:I0)
N$567: IC187.10(C:I1) IC187.11(D:O)
N$568: IC186.3(A:O) IC186.4(B:I0) IC186.12(D:I0)
N$573: IC185.3(A:O) IC185.4(B:I0) IC185.12(D:I0)
N$576: IC184.3(A:O) IC184.4(B:I0) IC184.12(D:I0)
N$577: IC184.6(B:O) IC184.9(C:I0)
N$578: IC184.10(C:I1) IC184.11(D:O)
N$579: IC183.6(B:O) IC183.9(C:I0)
N$580: IC183.10(C:I1) IC183.11(D:O)
N$581: IC183.3(A:O) IC183.4(B:I0) IC183.12(D:I0)
VCC: IC183.14(P:VCC) IC184.14(P:VCC) IC185.14(P:VCC) IC186.14(P:VCC) IC187.14(P:VCC) IC188.14(P:VCC) IC189.14(P:VCC) IC190.14(P:VCC) ; also sheet 1,2,3,4,5,6,7,8,9,10,11,12,13,14,15,16,17,18,19,20,21,22,23,24,26,27,28,29,30,31,32,33,34,37,38,39,40,41,42,43,44,45,46,47
XOR0: IC183.8(C:O) ; also sheet 45
XOR1: IC184.8(C:O) ; also sheet 45
XOR2: IC185.8(C:O) ; also sheet 45
XOR3: IC186.8(C:O) ; also sheet 45
XOR4: IC187.8(C:O) ; also sheet 44
XOR5: IC188.8(C:O) ; also sheet 44
XOR6: IC189.8(C:O) ; also sheet 44
XOR7: IC190.8(C:O) ; also sheet 44

### Notes on the sheet
- XOR

## Sheet 26 of 48: ADDSUB 0-3
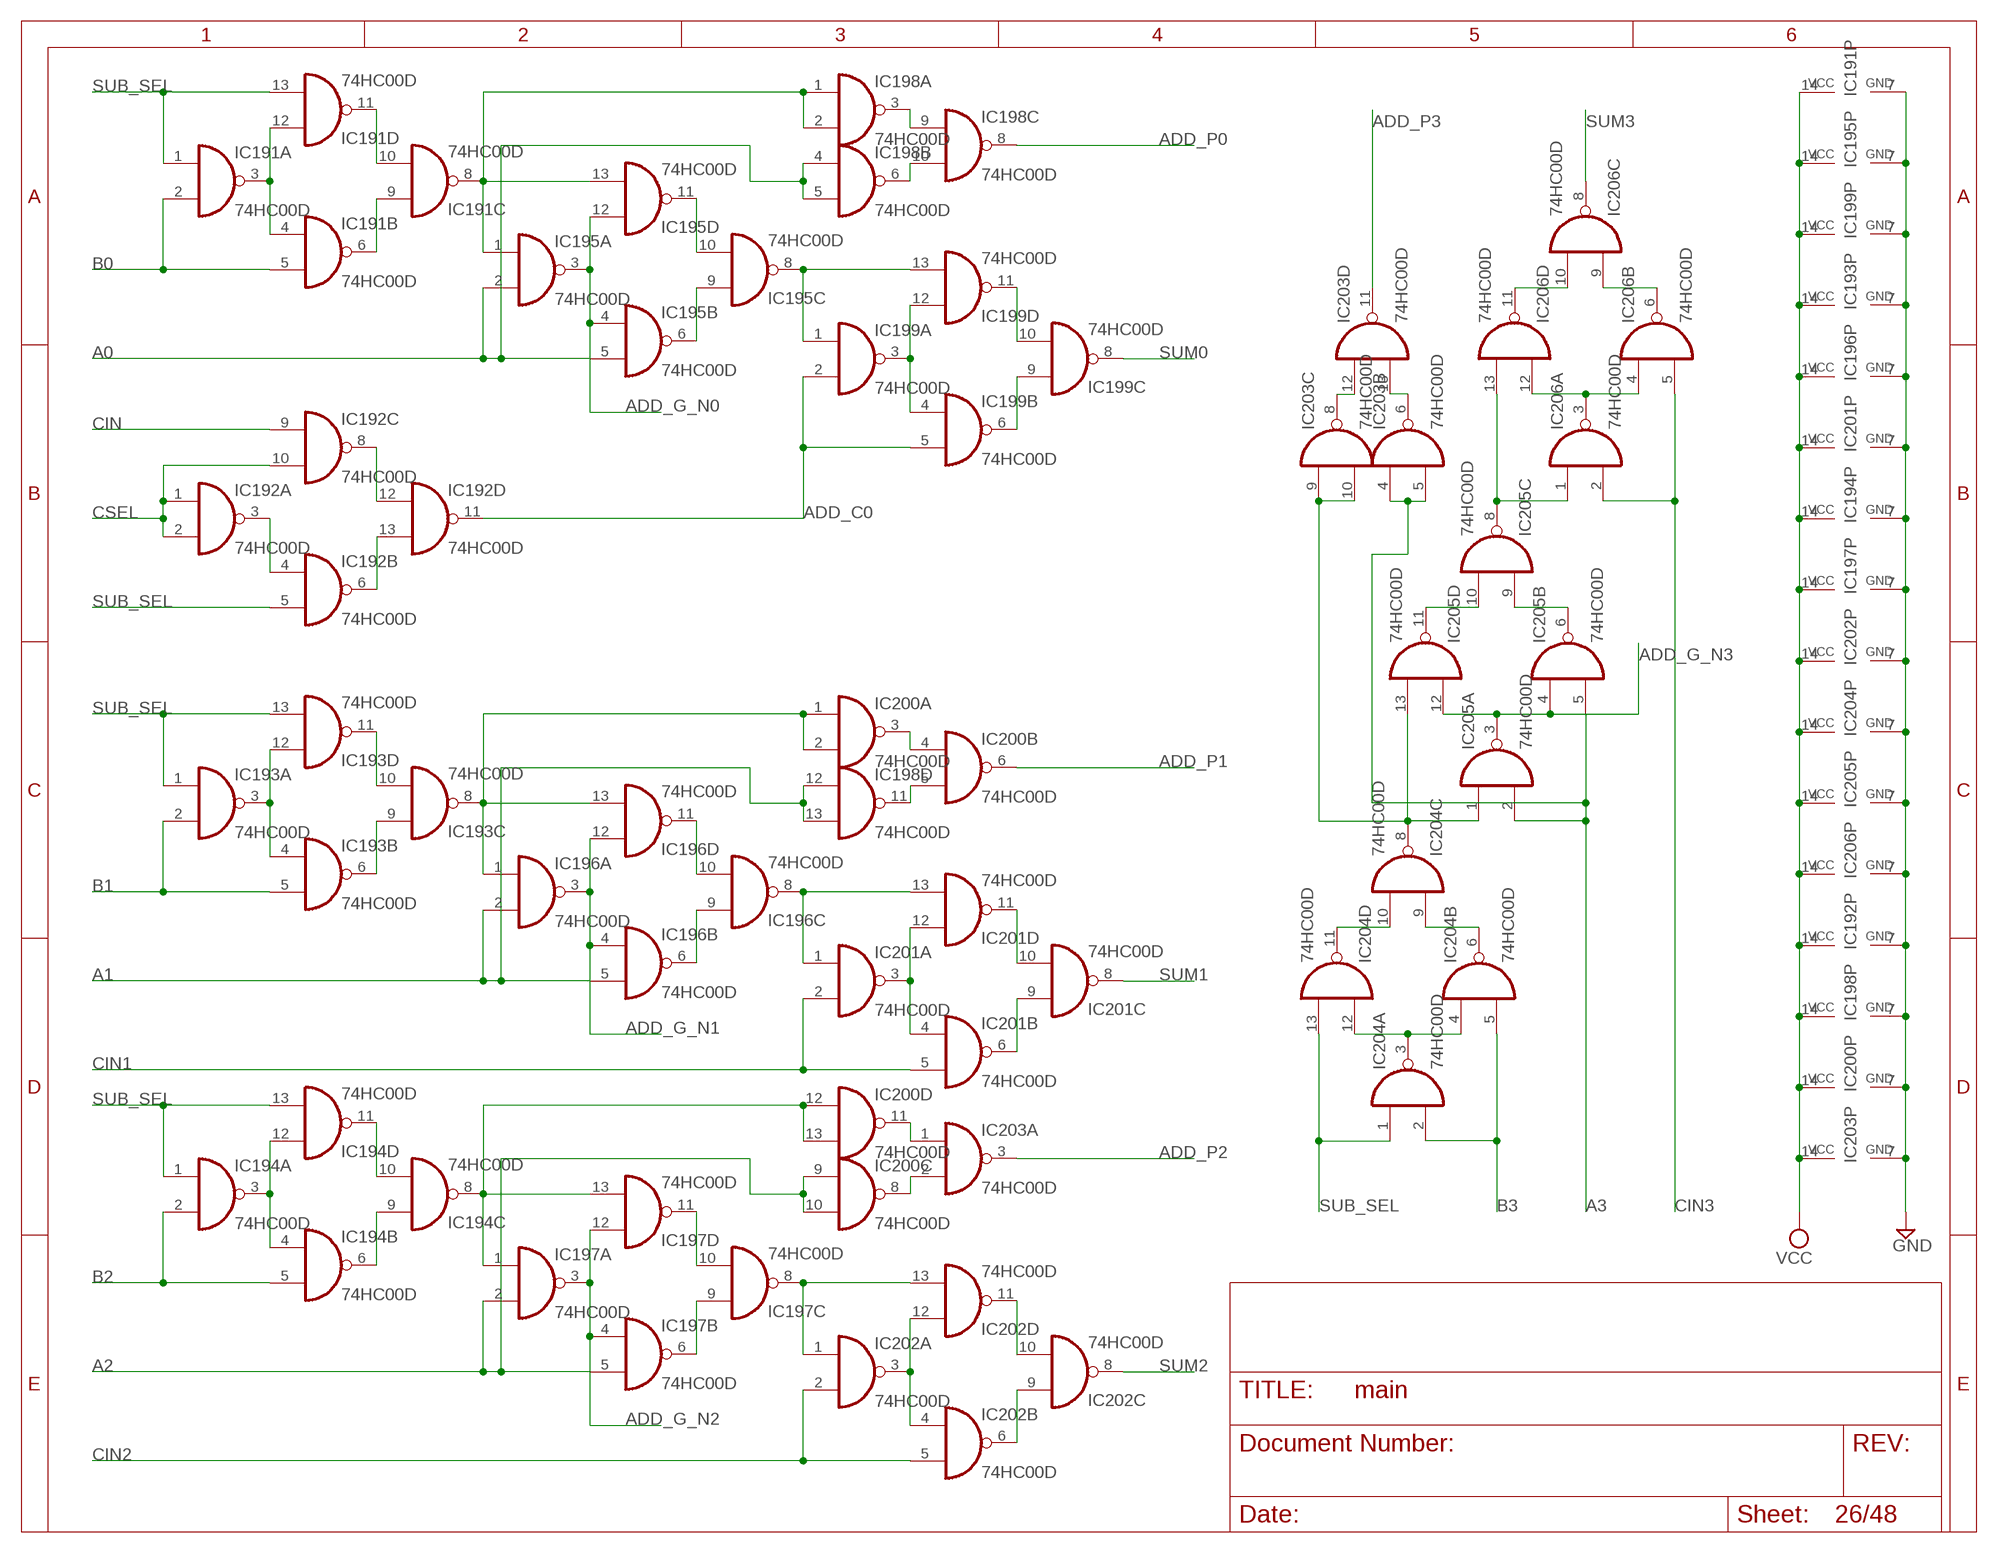
[diagram p25: schematic, sheet 26]

### Parts
IC191  74HC00D  [SO14]
IC192  74HC00D  [SO14]
IC193  74HC00D  [SO14]
IC194  74HC00D  [SO14]
IC195  74HC00D  [SO14]
IC196  74HC00D  [SO14]
IC197  74HC00D  [SO14]
IC198  74HC00D  [SO14]
IC199  74HC00D  [SO14]
IC200  74HC00D  [SO14]
IC201  74HC00D  [SO14]
IC202  74HC00D  [SO14]
IC203  74HC00D  [SO14]
IC204  74HC00D  [SO14]
IC205  74HC00D  [SO14]
IC206  74HC00D  [SO14]

### Nets
A0: IC195.2(A:I1) IC195.5(B:I1) IC198.4(B:I0) IC198.5(B:I1) ; also sheet 1,3,4,11,24,25,30,34,41
A1: IC196.2(A:I1) IC196.5(B:I1) IC198.12(D:I0) IC198.13(D:I1) ; also sheet 1,3,4,11,19,24,25,30,34,41
A2: IC197.2(A:I1) IC197.5(B:I1) IC200.9(C:I0) IC200.10(C:I1) ; also sheet 1,24,25,30,34,41
A3: IC203.4(B:I0) IC203.5(B:I1) IC205.2(A:I1) IC205.5(B:I1) ; also sheet 1,2,5,6,11,22,24,25,30,34,41
ADD_C0: IC192.11(D:O) IC199.2(A:I1) IC199.5(B:I1) ; also sheet 28
ADD_G_N0: IC195.3(A:O) IC195.4(B:I0) IC195.12(D:I0) ; also sheet 28
ADD_G_N1: IC196.3(A:O) IC196.4(B:I0) IC196.12(D:I0) ; also sheet 28
ADD_G_N2: IC197.3(A:O) IC197.4(B:I0) IC197.12(D:I0) ; also sheet 28
ADD_G_N3: IC205.3(A:O) IC205.4(B:I0) IC205.12(D:I0) ; also sheet 28
ADD_P0: IC198.8(C:O) ; also sheet 28
ADD_P1: IC200.6(B:O) ; also sheet 28
ADD_P2: IC203.3(A:O) ; also sheet 28
ADD_P3: IC203.11(D:O) ; also sheet 28
B0: IC191.2(A:I1) IC191.5(B:I1) ; also sheet 4,6,8,10,11,24,25,34,43
B1: IC193.2(A:I1) IC193.5(B:I1) ; also sheet 4,6,8,10,24,25,34,43
B2: IC194.2(A:I1) IC194.5(B:I1) ; also sheet 4,6,8,10,24,25,34,43
B3: IC204.2(A:I1) IC204.5(B:I1) ; also sheet 4,6,8,10,24,25,34,43
CIN: IC192.9(C:I0)
CIN1: IC201.2(A:I1) IC201.5(B:I1) ; also sheet 28
CIN2: IC202.2(A:I1) IC202.5(B:I1) ; also sheet 28
CIN3: IC206.2(A:I1) IC206.5(B:I1) ; also sheet 28
CSEL: IC192.1(A:I0) IC192.2(A:I1) IC192.10(C:I1) ; also sheet 37
GND: IC191.7(P:GND) IC192.7(P:GND) IC193.7(P:GND) IC194.7(P:GND) IC195.7(P:GND) IC196.7(P:GND) IC197.7(P:GND) IC198.7(P:GND) IC199.7(P:GND) IC200.7(P:GND) IC201.7(P:GND) IC202.7(P:GND) IC203.7(P:GND) IC204.7(P:GND) IC205.7(P:GND) IC206.7(P:GND) ; also sheet 1,2,3,4,5,6,7,8,9,10,11,12,13,14,15,16,17,18,19,20,21,22,23,24,25,27,28,29,30,31,32,33,34,37,38,39,40,41,42,43,44,45,46,47
N$546: IC191.6(B:O) IC191.9(C:I0)
N$547: IC191.10(C:I1) IC191.11(D:O)
N$548: IC191.3(A:O) IC191.4(B:I0) IC191.12(D:I0)
N$562: IC195.6(B:O) IC195.9(C:I0)
N$563: IC195.10(C:I1) IC195.11(D:O)
N$564: IC199.10(C:I1) IC199.11(D:O)
N$569: IC199.6(B:O) IC199.9(C:I0)
N$570: IC199.3(A:O) IC199.4(B:I0) IC199.12(D:I0)
N$571: IC195.8(C:O) IC199.1(A:I0) IC199.13(D:I1)
N$583: IC193.6(B:O) IC193.9(C:I0)
N$584: IC193.10(C:I1) IC193.11(D:O)
N$585: IC193.3(A:O) IC193.4(B:I0) IC193.12(D:I0)
N$588: IC196.6(B:O) IC196.9(C:I0)
N$589: IC196.10(C:I1) IC196.11(D:O)
N$590: IC201.10(C:I1) IC201.11(D:O)
N$591: IC201.6(B:O) IC201.9(C:I0)
N$592: IC201.3(A:O) IC201.4(B:I0) IC201.12(D:I0)
N$593: IC196.8(C:O) IC201.1(A:I0) IC201.13(D:I1)
N$594: IC194.6(B:O) IC194.9(C:I0)
N$595: IC194.10(C:I1) IC194.11(D:O)
N$596: IC194.3(A:O) IC194.4(B:I0) IC194.12(D:I0)
N$598: IC197.6(B:O) IC197.9(C:I0)
N$599: IC197.10(C:I1) IC197.11(D:O)
N$600: IC202.10(C:I1) IC202.11(D:O)
N$601: IC202.6(B:O) IC202.9(C:I0)
N$602: IC202.3(A:O) IC202.4(B:I0) IC202.12(D:I0)
N$603: IC197.8(C:O) IC202.1(A:I0) IC202.13(D:I1)
N$604: IC204.6(B:O) IC204.9(C:I0)
N$605: IC204.10(C:I1) IC204.11(D:O)
N$606: IC204.3(A:O) IC204.4(B:I0) IC204.12(D:I0)
N$607: IC203.9(C:I0) IC203.10(C:I1) IC204.8(C:O) IC205.1(A:I0) IC205.13(D:I1)
N$608: IC205.6(B:O) IC205.9(C:I0)
N$609: IC205.10(C:I1) IC205.11(D:O)
N$610: IC206.10(C:I1) IC206.11(D:O)
N$611: IC206.6(B:O) IC206.9(C:I0)
N$612: IC206.3(A:O) IC206.4(B:I0) IC206.12(D:I0)
N$613: IC205.8(C:O) IC206.1(A:I0) IC206.13(D:I1)
N$614: IC192.3(A:O) IC192.4(B:I0)
N$616: IC192.8(C:O) IC192.12(D:I0)
N$617: IC192.6(B:O) IC192.13(D:I1)
N$621: IC191.8(C:O) IC195.1(A:I0) IC195.13(D:I1) IC198.1(A:I0) IC198.2(A:I1)
N$622: IC198.6(B:O) IC198.10(C:I1)
N$623: IC198.3(A:O) IC198.9(C:I0)
N$625: IC193.8(C:O) IC196.1(A:I0) IC196.13(D:I1) IC200.1(A:I0) IC200.2(A:I1)
N$628: IC198.11(D:O) IC200.5(B:I1)
N$629: IC200.3(A:O) IC200.4(B:I0)
N$630: IC200.11(D:O) IC203.1(A:I0)
N$631: IC200.8(C:O) IC203.2(A:I1)
N$634: IC194.8(C:O) IC197.1(A:I0) IC197.13(D:I1) IC200.12(D:I0) IC200.13(D:I1)
N$637: IC203.6(B:O) IC203.13(D:I1)
N$638: IC203.8(C:O) IC203.12(D:I0)
SUB_SEL: IC191.1(A:I0) IC191.13(D:I1) IC192.5(B:I1) IC193.1(A:I0) IC193.13(D:I1) IC194.1(A:I0) IC194.13(D:I1) IC204.1(A:I0) IC204.13(D:I1) ; also sheet 27,37
SUM0: IC199.8(C:O) ; also sheet 29,45
SUM1: IC201.8(C:O) ; also sheet 29,45
SUM2: IC202.8(C:O) ; also sheet 29,45
SUM3: IC206.8(C:O) ; also sheet 29,45
VCC: IC191.14(P:VCC) IC192.14(P:VCC) IC193.14(P:VCC) IC194.14(P:VCC) IC195.14(P:VCC) IC196.14(P:VCC) IC197.14(P:VCC) IC198.14(P:VCC) IC199.14(P:VCC) IC200.14(P:VCC) IC201.14(P:VCC) IC202.14(P:VCC) IC203.14(P:VCC) IC204.14(P:VCC) IC205.14(P:VCC) IC206.14(P:VCC) ; also sheet 1,2,3,4,5,6,7,8,9,10,11,12,13,14,15,16,17,18,19,20,21,22,23,24,25,27,28,29,30,31,32,33,34,37,38,39,40,41,42,43,44,45,46,47

## Sheet 27 of 48: ADDSUB 4-7
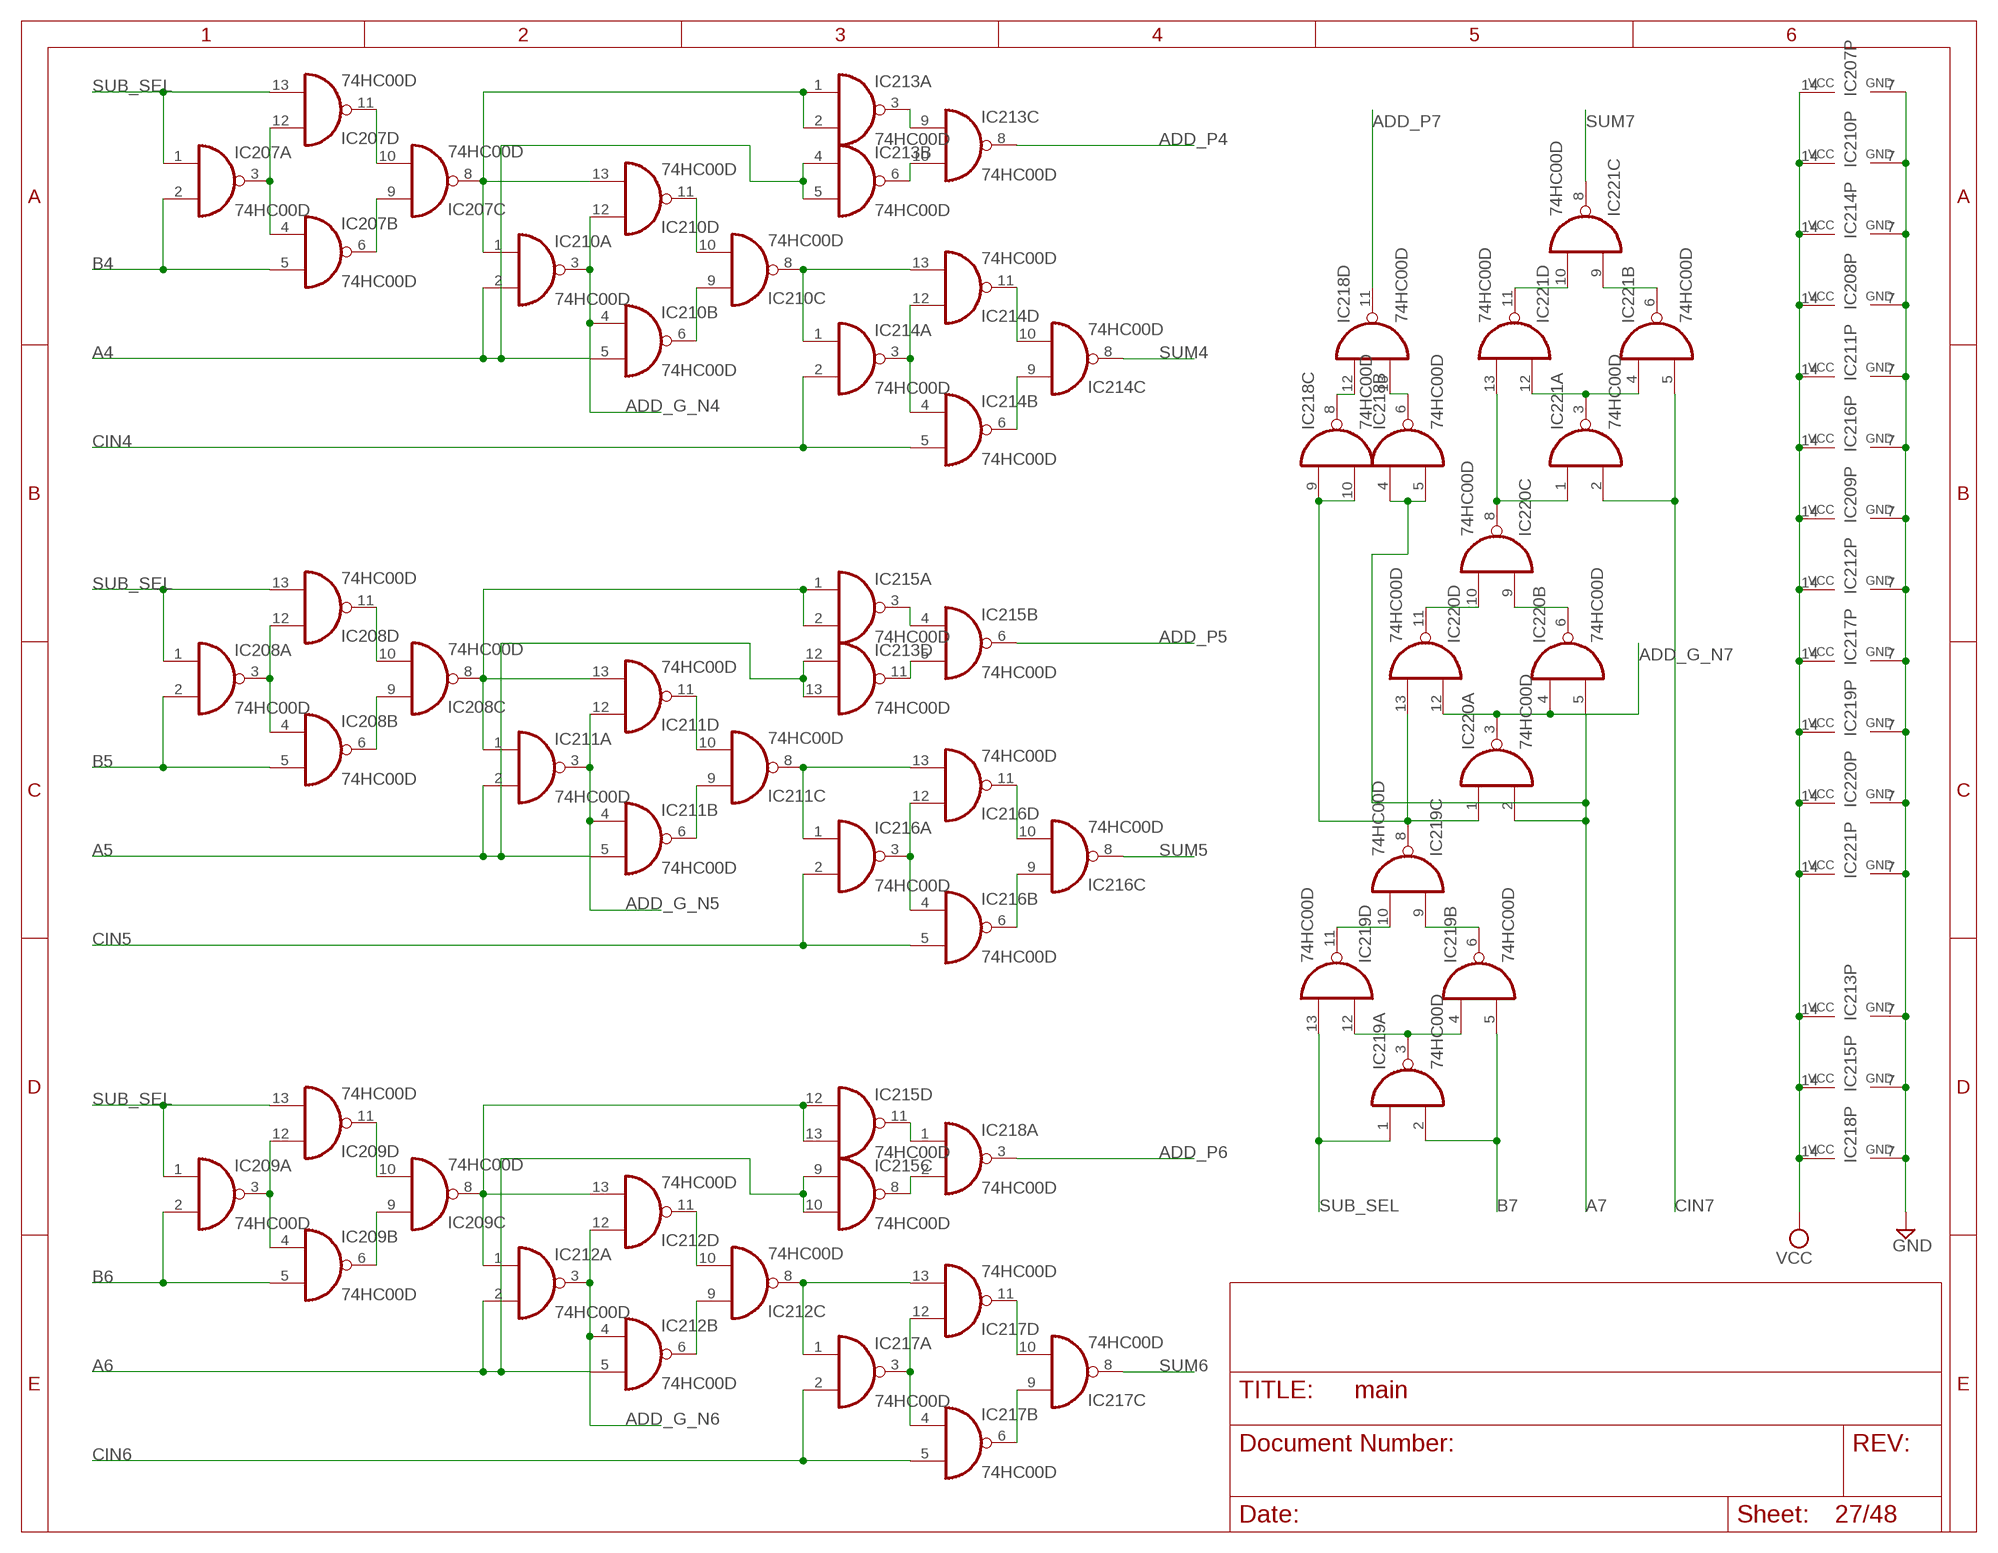
[diagram p26: schematic, sheet 27]

### Parts
IC207  74HC00D  [SO14]
IC208  74HC00D  [SO14]
IC209  74HC00D  [SO14]
IC210  74HC00D  [SO14]
IC211  74HC00D  [SO14]
IC212  74HC00D  [SO14]
IC213  74HC00D  [SO14]
IC214  74HC00D  [SO14]
IC215  74HC00D  [SO14]
IC216  74HC00D  [SO14]
IC217  74HC00D  [SO14]
IC218  74HC00D  [SO14]
IC219  74HC00D  [SO14]
IC220  74HC00D  [SO14]
IC221  74HC00D  [SO14]

### Nets
A4: IC210.2(A:I1) IC210.5(B:I1) IC213.4(B:I0) IC213.5(B:I1) ; also sheet 2,24,25,30,34,40
A5: IC211.2(A:I1) IC211.5(B:I1) IC213.12(D:I0) IC213.13(D:I1) ; also sheet 2,7,8,11,16,24,25,30,34,40
A6: IC212.2(A:I1) IC212.5(B:I1) IC215.9(C:I0) IC215.10(C:I1) ; also sheet 2,24,25,30,34,40
A7: IC218.4(B:I0) IC218.5(B:I1) IC220.2(A:I1) IC220.5(B:I1) ; also sheet 2,9,10,11,15,24,25,30,34,40
ADD_G_N4: IC210.3(A:O) IC210.4(B:I0) IC210.12(D:I0) ; also sheet 28
ADD_G_N5: IC211.3(A:O) IC211.4(B:I0) IC211.12(D:I0) ; also sheet 28
ADD_G_N6: IC212.3(A:O) IC212.4(B:I0) IC212.12(D:I0) ; also sheet 28
ADD_G_N7: IC220.3(A:O) IC220.4(B:I0) IC220.12(D:I0) ; also sheet 28
ADD_P4: IC213.8(C:O) ; also sheet 28
ADD_P5: IC215.6(B:O) ; also sheet 28
ADD_P6: IC218.3(A:O) ; also sheet 28
ADD_P7: IC218.11(D:O) ; also sheet 28
B4: IC207.2(A:I1) IC207.5(B:I1) ; also sheet 3,4,5,6,7,8,9,10,24,25,34,42
B5: IC208.2(A:I1) IC208.5(B:I1) ; also sheet 3,5,7,9,24,25,34,42
B6: IC209.2(A:I1) IC209.5(B:I1) ; also sheet 3,5,7,9,24,25,34,42
B7: IC219.2(A:I1) IC219.5(B:I1) ; also sheet 3,5,7,9,24,25,34,42
CIN4: IC214.2(A:I1) IC214.5(B:I1) ; also sheet 28
CIN5: IC216.2(A:I1) IC216.5(B:I1) ; also sheet 28
CIN6: IC217.2(A:I1) IC217.5(B:I1) ; also sheet 28
CIN7: IC221.2(A:I1) IC221.5(B:I1) ; also sheet 28,29
GND: IC207.7(P:GND) IC208.7(P:GND) IC209.7(P:GND) IC210.7(P:GND) IC211.7(P:GND) IC212.7(P:GND) IC213.7(P:GND) IC214.7(P:GND) IC215.7(P:GND) IC216.7(P:GND) IC217.7(P:GND) IC218.7(P:GND) IC219.7(P:GND) IC220.7(P:GND) IC221.7(P:GND) ; also sheet 1,2,3,4,5,6,7,8,9,10,11,12,13,14,15,16,17,18,19,20,21,22,23,24,25,26,28,29,30,31,32,33,34,37,38,39,40,41,42,43,44,45,46,47
N$549: IC207.6(B:O) IC207.9(C:I0)
N$561: IC207.10(C:I1) IC207.11(D:O)
N$574: IC207.3(A:O) IC207.4(B:I0) IC207.12(D:I0)
N$575: IC210.6(B:O) IC210.9(C:I0)
N$582: IC210.10(C:I1) IC210.11(D:O)
N$586: IC214.10(C:I1) IC214.11(D:O)
N$587: IC214.6(B:O) IC214.9(C:I0)
N$597: IC214.3(A:O) IC214.4(B:I0) IC214.12(D:I0)
N$615: IC210.8(C:O) IC214.1(A:I0) IC214.13(D:I1)
N$619: IC208.6(B:O) IC208.9(C:I0)
N$620: IC208.10(C:I1) IC208.11(D:O)
N$624: IC208.3(A:O) IC208.4(B:I0) IC208.12(D:I0)
N$626: IC211.6(B:O) IC211.9(C:I0)
N$627: IC211.10(C:I1) IC211.11(D:O)
N$632: IC216.10(C:I1) IC216.11(D:O)
N$633: IC216.6(B:O) IC216.9(C:I0)
N$635: IC216.3(A:O) IC216.4(B:I0) IC216.12(D:I0)
N$636: IC211.8(C:O) IC216.1(A:I0) IC216.13(D:I1)
N$639: IC209.6(B:O) IC209.9(C:I0)
N$640: IC209.10(C:I1) IC209.11(D:O)
N$641: IC209.3(A:O) IC209.4(B:I0) IC209.12(D:I0)
N$642: IC212.6(B:O) IC212.9(C:I0)
N$643: IC212.10(C:I1) IC212.11(D:O)
N$644: IC217.10(C:I1) IC217.11(D:O)
N$645: IC217.6(B:O) IC217.9(C:I0)
N$646: IC217.3(A:O) IC217.4(B:I0) IC217.12(D:I0)
N$647: IC212.8(C:O) IC217.1(A:I0) IC217.13(D:I1)
N$648: IC219.6(B:O) IC219.9(C:I0)
N$649: IC219.10(C:I1) IC219.11(D:O)
N$650: IC219.3(A:O) IC219.4(B:I0) IC219.12(D:I0)
N$651: IC218.9(C:I0) IC218.10(C:I1) IC219.8(C:O) IC220.1(A:I0) IC220.13(D:I1)
N$652: IC220.6(B:O) IC220.9(C:I0)
N$653: IC220.10(C:I1) IC220.11(D:O)
N$654: IC221.10(C:I1) IC221.11(D:O)
N$655: IC221.6(B:O) IC221.9(C:I0)
N$656: IC221.3(A:O) IC221.4(B:I0) IC221.12(D:I0)
N$657: IC220.8(C:O) IC221.1(A:I0) IC221.13(D:I1)
N$661: IC207.8(C:O) IC210.1(A:I0) IC210.13(D:I1) IC213.1(A:I0) IC213.2(A:I1)
N$662: IC213.6(B:O) IC213.10(C:I1)
N$663: IC213.3(A:O) IC213.9(C:I0)
N$664: IC208.8(C:O) IC211.1(A:I0) IC211.13(D:I1) IC215.1(A:I0) IC215.2(A:I1)
N$665: IC213.11(D:O) IC215.5(B:I1)
N$666: IC215.3(A:O) IC215.4(B:I0)
N$667: IC215.11(D:O) IC218.1(A:I0)
N$668: IC215.8(C:O) IC218.2(A:I1)
N$669: IC209.8(C:O) IC212.1(A:I0) IC212.13(D:I1) IC215.12(D:I0) IC215.13(D:I1)
N$670: IC218.6(B:O) IC218.13(D:I1)
N$671: IC218.8(C:O) IC218.12(D:I0)
SUB_SEL: IC207.1(A:I0) IC207.13(D:I1) IC208.1(A:I0) IC208.13(D:I1) IC209.1(A:I0) IC209.13(D:I1) IC219.1(A:I0) IC219.13(D:I1) ; also sheet 26,37
SUM4: IC214.8(C:O) ; also sheet 29,44
SUM5: IC216.8(C:O) ; also sheet 29,44
SUM6: IC217.8(C:O) ; also sheet 29,44
SUM7: IC221.8(C:O) ; also sheet 29,44
VCC: IC207.14(P:VCC) IC208.14(P:VCC) IC209.14(P:VCC) IC210.14(P:VCC) IC211.14(P:VCC) IC212.14(P:VCC) IC213.14(P:VCC) IC214.14(P:VCC) IC215.14(P:VCC) IC216.14(P:VCC) IC217.14(P:VCC) IC218.14(P:VCC) IC219.14(P:VCC) IC220.14(P:VCC) IC221.14(P:VCC) ; also sheet 1,2,3,4,5,6,7,8,9,10,11,12,13,14,15,16,17,18,19,20,21,22,23,24,25,26,28,29,30,31,32,33,34,37,38,39,40,41,42,43,44,45,46,47

## Sheet 28 of 48: ADDSUB CLU
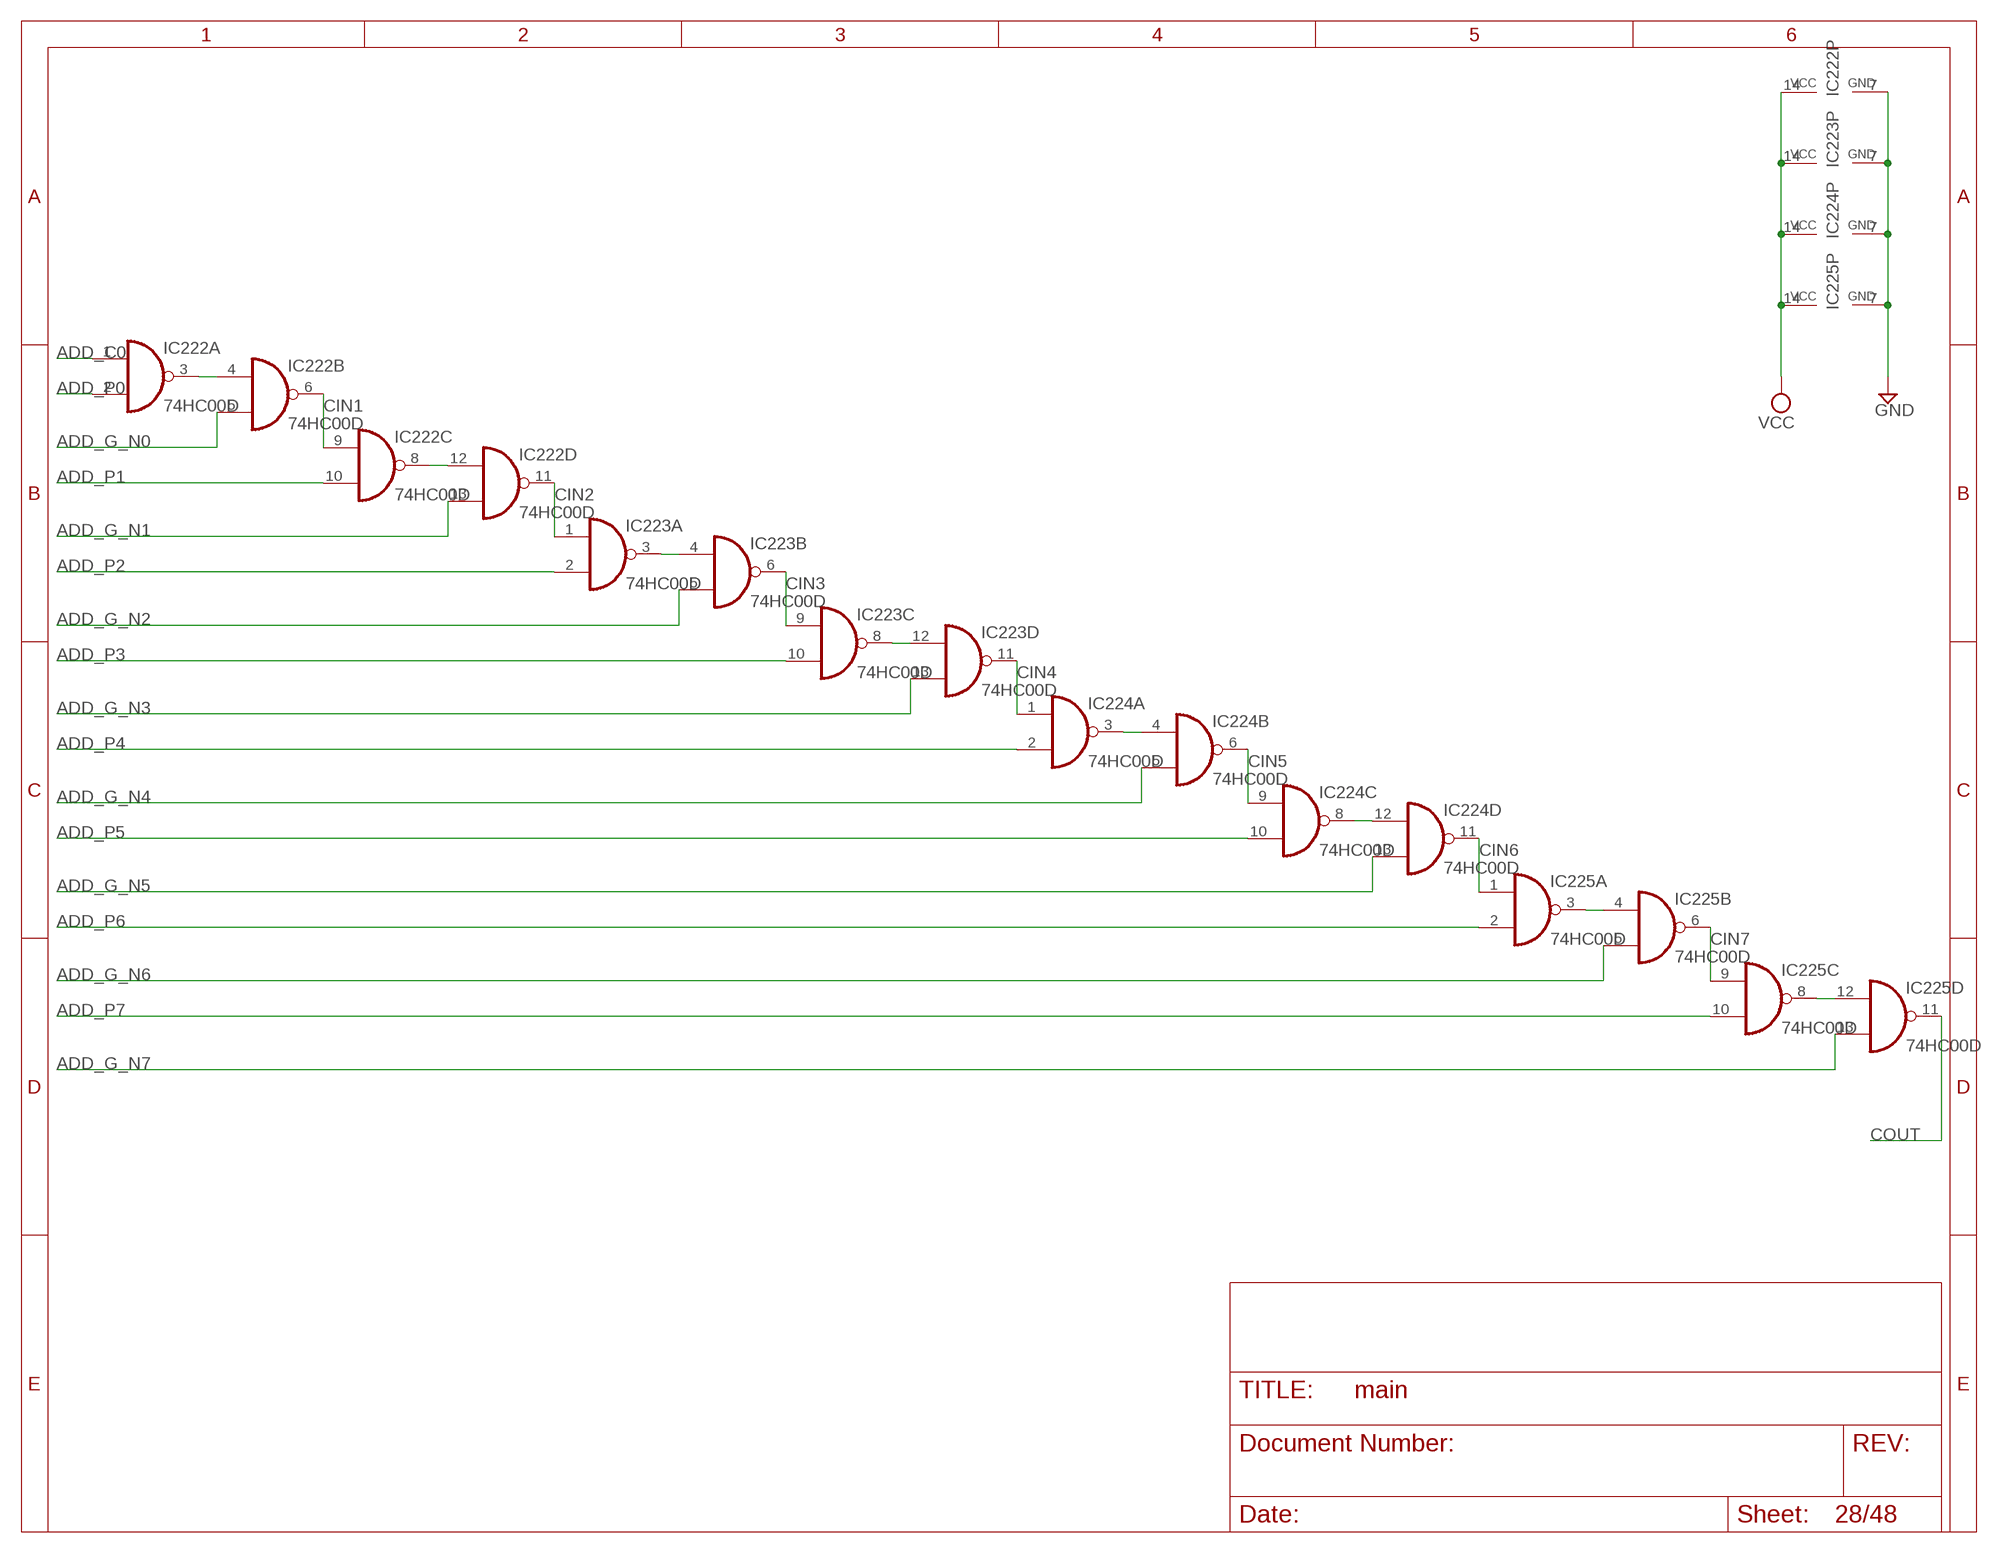
[diagram p27: schematic, sheet 28]

### Parts
IC222  74HC00D  [SO14]
IC223  74HC00D  [SO14]
IC224  74HC00D  [SO14]
IC225  74HC00D  [SO14]

### Nets
ADD_C0: IC222.1(A:I0) ; also sheet 26
ADD_G_N0: IC222.5(B:I1) ; also sheet 26
ADD_G_N1: IC222.13(D:I1) ; also sheet 26
ADD_G_N2: IC223.5(B:I1) ; also sheet 26
ADD_G_N3: IC223.13(D:I1) ; also sheet 26
ADD_G_N4: IC224.5(B:I1) ; also sheet 27
ADD_G_N5: IC224.13(D:I1) ; also sheet 27
ADD_G_N6: IC225.5(B:I1) ; also sheet 27
ADD_G_N7: IC225.13(D:I1) ; also sheet 27
ADD_P0: IC222.2(A:I1) ; also sheet 26
ADD_P1: IC222.10(C:I1) ; also sheet 26
ADD_P2: IC223.2(A:I1) ; also sheet 26
ADD_P3: IC223.10(C:I1) ; also sheet 26
ADD_P4: IC224.2(A:I1) ; also sheet 27
ADD_P5: IC224.10(C:I1) ; also sheet 27
ADD_P6: IC225.2(A:I1) ; also sheet 27
ADD_P7: IC225.10(C:I1) ; also sheet 27
CIN1: IC222.6(B:O) IC222.9(C:I0) ; also sheet 26
CIN2: IC222.11(D:O) IC223.1(A:I0) ; also sheet 26
CIN3: IC223.6(B:O) IC223.9(C:I0) ; also sheet 26
CIN4: IC223.11(D:O) IC224.1(A:I0) ; also sheet 27
CIN5: IC224.6(B:O) IC224.9(C:I0) ; also sheet 27
CIN6: IC224.11(D:O) IC225.1(A:I0) ; also sheet 27
CIN7: IC225.6(B:O) IC225.9(C:I0) ; also sheet 27,29
COUT: IC225.11(D:O) ; also sheet 29
GND: IC222.7(P:GND) IC223.7(P:GND) IC224.7(P:GND) IC225.7(P:GND) ; also sheet 1,2,3,4,5,6,7,8,9,10,11,12,13,14,15,16,17,18,19,20,21,22,23,24,25,26,27,29,30,31,32,33,34,37,38,39,40,41,42,43,44,45,46,47
N$672: IC222.8(C:O) IC222.12(D:I0)
N$674: IC223.3(A:O) IC223.4(B:I0)
N$676: IC223.8(C:O) IC223.12(D:I0)
N$678: IC224.3(A:O) IC224.4(B:I0)
N$680: IC224.8(C:O) IC224.12(D:I0)
N$681: IC225.3(A:O) IC225.4(B:I0)
N$684: IC225.8(C:O) IC225.12(D:I0)
N$685: IC222.3(A:O) IC222.4(B:I0)
VCC: IC222.14(P:VCC) IC223.14(P:VCC) IC224.14(P:VCC) IC225.14(P:VCC) ; also sheet 1,2,3,4,5,6,7,8,9,10,11,12,13,14,15,16,17,18,19,20,21,22,23,24,25,26,27,29,30,31,32,33,34,37,38,39,40,41,42,43,44,45,46,47

## Sheet 29 of 48: COMPARE
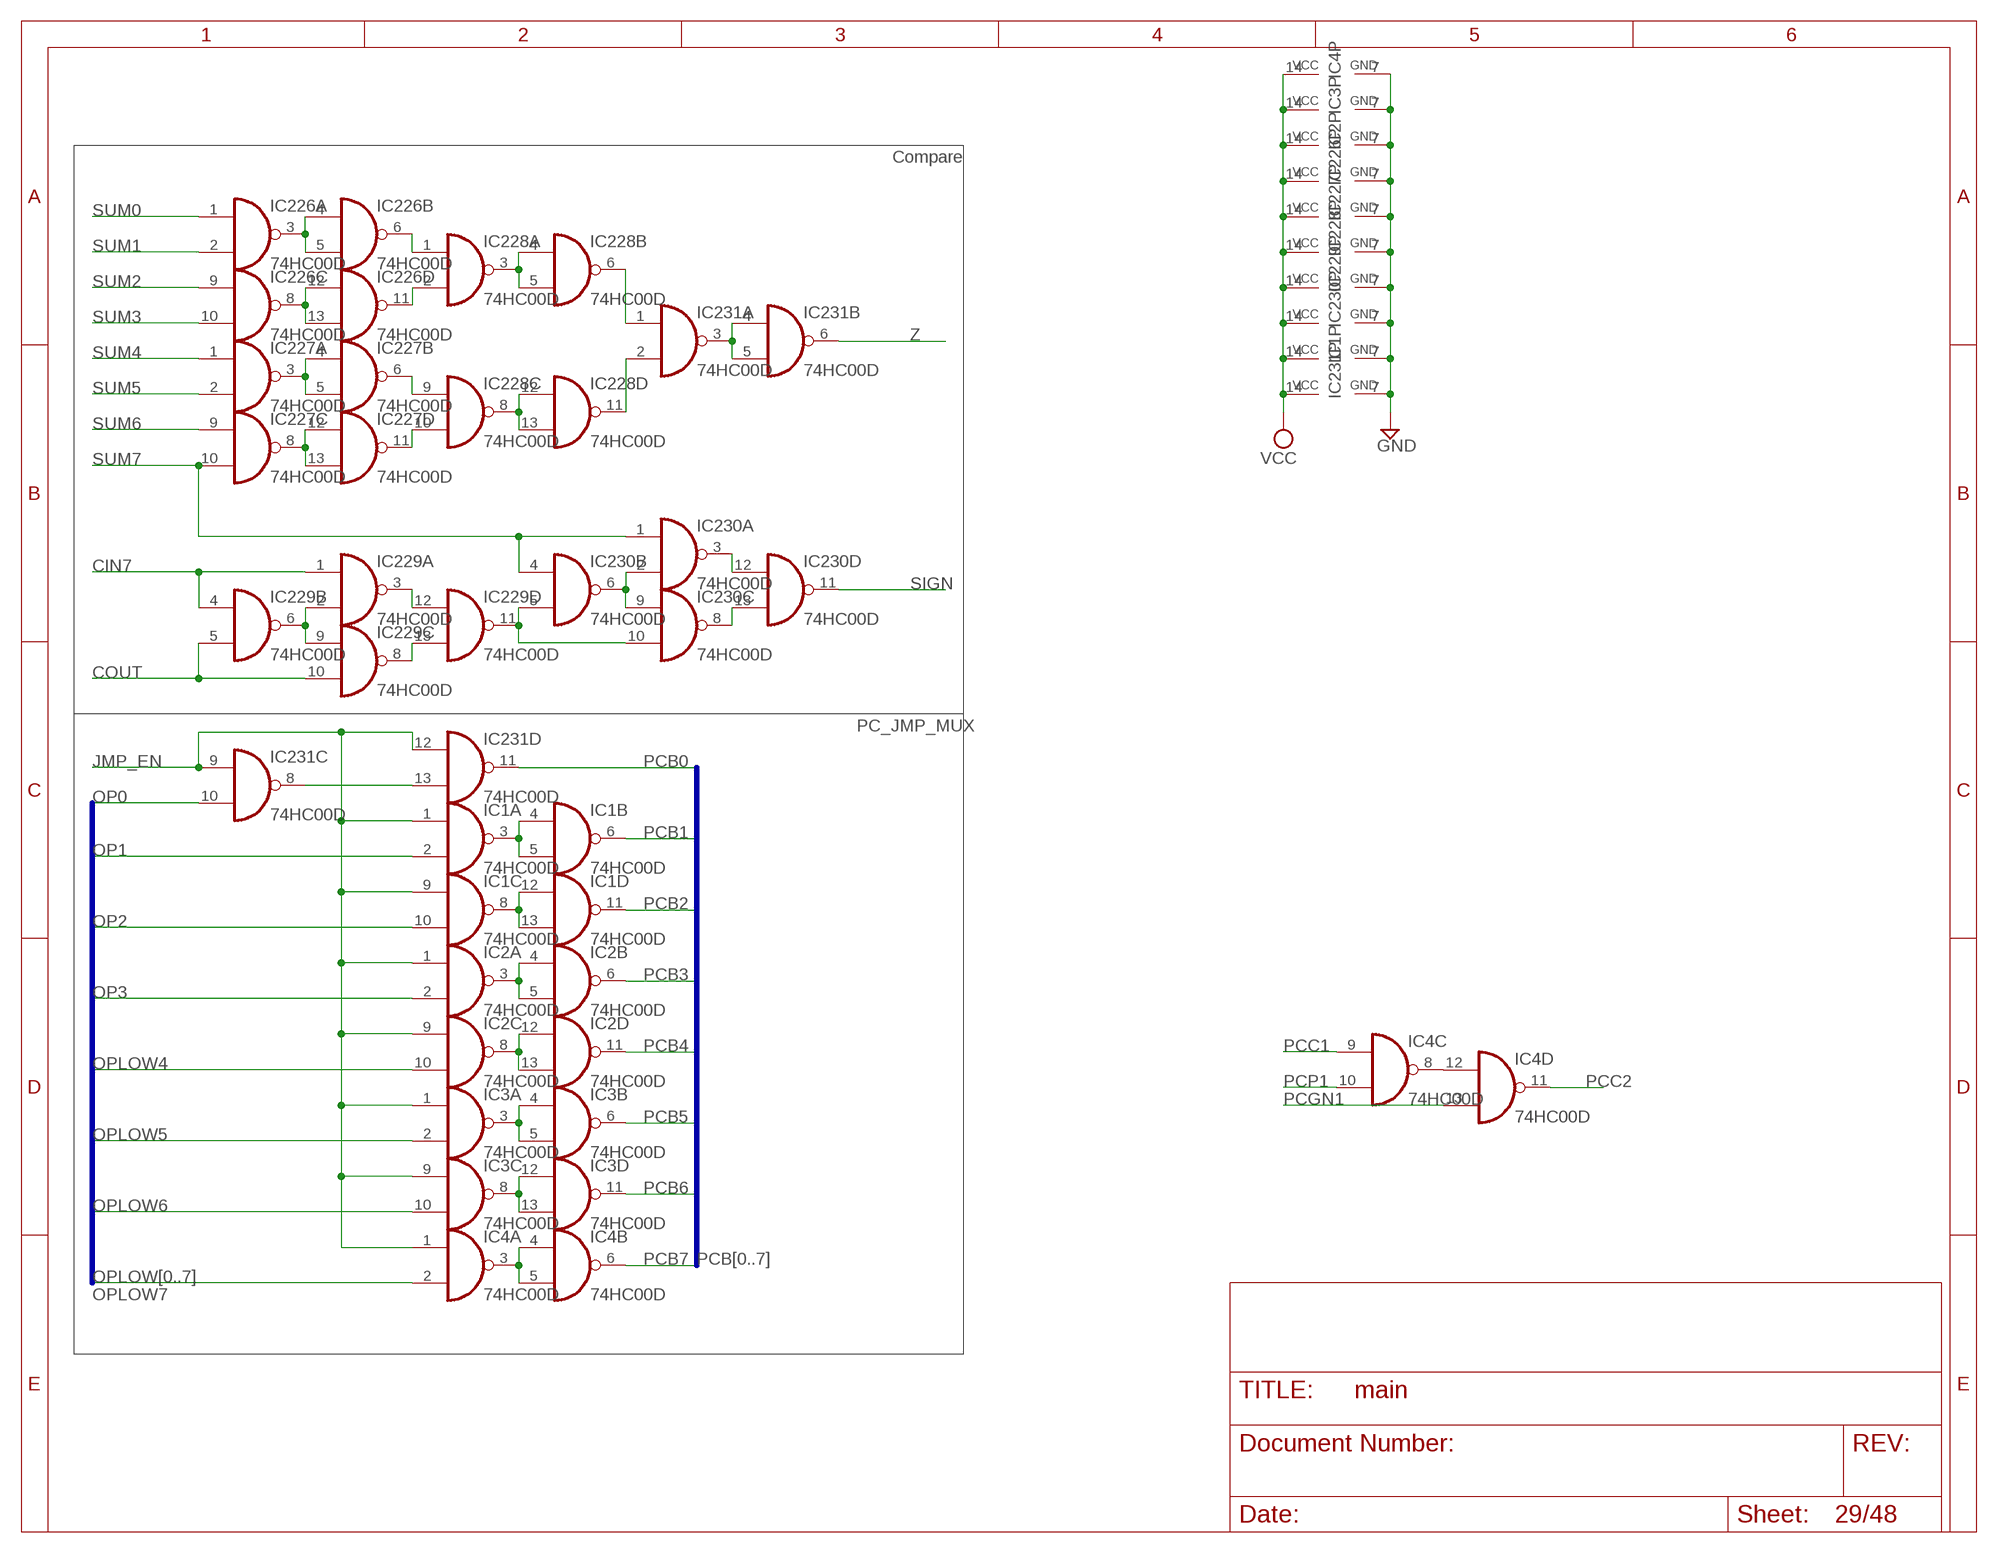
[diagram p28: schematic, sheet 29]

### Parts
IC1  74HC00D  [SO14]
IC2  74HC00D  [SO14]
IC3  74HC00D  [SO14]
IC4  74HC00D  [SO14]
IC226  74HC00D  [SO14]
IC227  74HC00D  [SO14]
IC228  74HC00D  [SO14]
IC229  74HC00D  [SO14]
IC230  74HC00D  [SO14]
IC231  74HC00D  [SO14]

### Nets
CIN7: IC229.1(A:I0) IC229.4(B:I0) ; also sheet 27,28
COUT: IC229.5(B:I1) IC229.10(C:I1) ; also sheet 28
GND: IC1.7(P:GND) IC2.7(P:GND) IC3.7(P:GND) IC4.7(P:GND) IC226.7(P:GND) IC227.7(P:GND) IC228.7(P:GND) IC229.7(P:GND) IC230.7(P:GND) IC231.7(P:GND) ; also sheet 1,2,3,4,5,6,7,8,9,10,11,12,13,14,15,16,17,18,19,20,21,22,23,24,25,26,27,28,30,31,32,33,34,37,38,39,40,41,42,43,44,45,46,47
JMP_EN: IC1.1(A:I0) IC1.9(C:I0) IC2.1(A:I0) IC2.9(C:I0) IC3.1(A:I0) IC3.9(C:I0) IC4.1(A:I0) IC231.9(C:I0) IC231.12(D:I0) ; also sheet 46
N$503: IC231.8(C:O) IC231.13(D:I1)
N$507: IC1.3(A:O) IC1.4(B:I0) IC1.5(B:I1)
N$682: IC1.8(C:O) IC1.12(D:I0) IC1.13(D:I1)
N$683: IC2.3(A:O) IC2.4(B:I0) IC2.5(B:I1)
N$686: IC2.8(C:O) IC2.12(D:I0) IC2.13(D:I1)
N$687: IC3.3(A:O) IC3.4(B:I0) IC3.5(B:I1)
N$688: IC3.8(C:O) IC3.12(D:I0) IC3.13(D:I1)
N$689: IC4.3(A:O) IC4.4(B:I0) IC4.5(B:I1)
N$690: IC4.8(C:O) IC4.12(D:I0)
N$699: IC226.3(A:O) IC226.4(B:I0) IC226.5(B:I1)
N$700: IC226.8(C:O) IC226.12(D:I0) IC226.13(D:I1)
N$701: IC227.3(A:O) IC227.4(B:I0) IC227.5(B:I1)
N$702: IC227.8(C:O) IC227.12(D:I0) IC227.13(D:I1)
N$703: IC229.2(A:I1) IC229.6(B:O) IC229.9(C:I0)
N$706: IC229.8(C:O) IC229.13(D:I1)
N$707: IC229.3(A:O) IC229.12(D:I0)
N$708: IC230.2(A:I1) IC230.6(B:O) IC230.9(C:I0)
N$710: IC229.11(D:O) IC230.5(B:I1) IC230.10(C:I1)
N$711: IC230.8(C:O) IC230.13(D:I1)
N$712: IC230.3(A:O) IC230.12(D:I0)
N$713: IC227.11(D:O) IC228.10(C:I1)
N$714: IC227.6(B:O) IC228.9(C:I0)
N$715: IC228.8(C:O) IC228.12(D:I0) IC228.13(D:I1)
N$716: IC226.11(D:O) IC228.2(A:I1)
N$717: IC226.6(B:O) IC228.1(A:I0)
N$718: IC228.3(A:O) IC228.4(B:I0) IC228.5(B:I1)
N$719: IC228.6(B:O) IC231.1(A:I0)
N$871: IC228.11(D:O) IC231.2(A:I1)
N$872: IC231.3(A:O) IC231.4(B:I0) IC231.5(B:I1)
OP0: IC231.10(C:I1) ; also sheet 30,39,45,46,47
OP1: IC1.2(A:I1) ; also sheet 30,39,45,46,47
OP2: IC1.10(C:I1) ; also sheet 30,37,39,45,46,47
OP3: IC2.2(A:I1) ; also sheet 30,39,45,47
OPLOW4: IC2.10(C:I1)
OPLOW5: IC3.2(A:I1)
OPLOW6: IC3.10(C:I1)
OPLOW7: IC4.2(A:I1)
PCB0: IC231.11(D:O) ; also sheet 31
PCB1: IC1.6(B:O) ; also sheet 31
PCB2: IC1.11(D:O) ; also sheet 31
PCB3: IC2.6(B:O) ; also sheet 31
PCB4: IC2.11(D:O) ; also sheet 31
PCB5: IC3.6(B:O) ; also sheet 31
PCB6: IC3.11(D:O) ; also sheet 31
PCB7: IC4.6(B:O) ; also sheet 31,32
PCC1: IC4.9(C:I0) ; also sheet 12,31
PCC2: IC4.11(D:O) ; also sheet 31,32
PCGN1: IC4.13(D:I1) ; also sheet 31
PCP1: IC4.10(C:I1) ; also sheet 31
SIGN: IC230.11(D:O)
SUM0: IC226.1(A:I0) ; also sheet 26,45
SUM1: IC226.2(A:I1) ; also sheet 26,45
SUM2: IC226.9(C:I0) ; also sheet 26,45
SUM3: IC226.10(C:I1) ; also sheet 26,45
SUM4: IC227.1(A:I0) ; also sheet 27,44
SUM5: IC227.2(A:I1) ; also sheet 27,44
SUM6: IC227.9(C:I0) ; also sheet 27,44
SUM7: IC227.10(C:I1) IC230.1(A:I0) IC230.4(B:I0) ; also sheet 27,44
VCC: IC1.14(P:VCC) IC2.14(P:VCC) IC3.14(P:VCC) IC4.14(P:VCC) IC226.14(P:VCC) IC227.14(P:VCC) IC228.14(P:VCC) IC229.14(P:VCC) IC230.14(P:VCC) IC231.14(P:VCC) ; also sheet 1,2,3,4,5,6,7,8,9,10,11,12,13,14,15,16,17,18,19,20,21,22,23,24,25,26,27,28,30,31,32,33,34,37,38,39,40,41,42,43,44,45,46,47
Z: IC231.6(B:O) ; also sheet 46

### Buses
PCB[0..7]
OPLOW[0..7]

### Notes on the sheet
- Compare
- PC_JMP_MUX

## Sheet 30 of 48: SHIFT
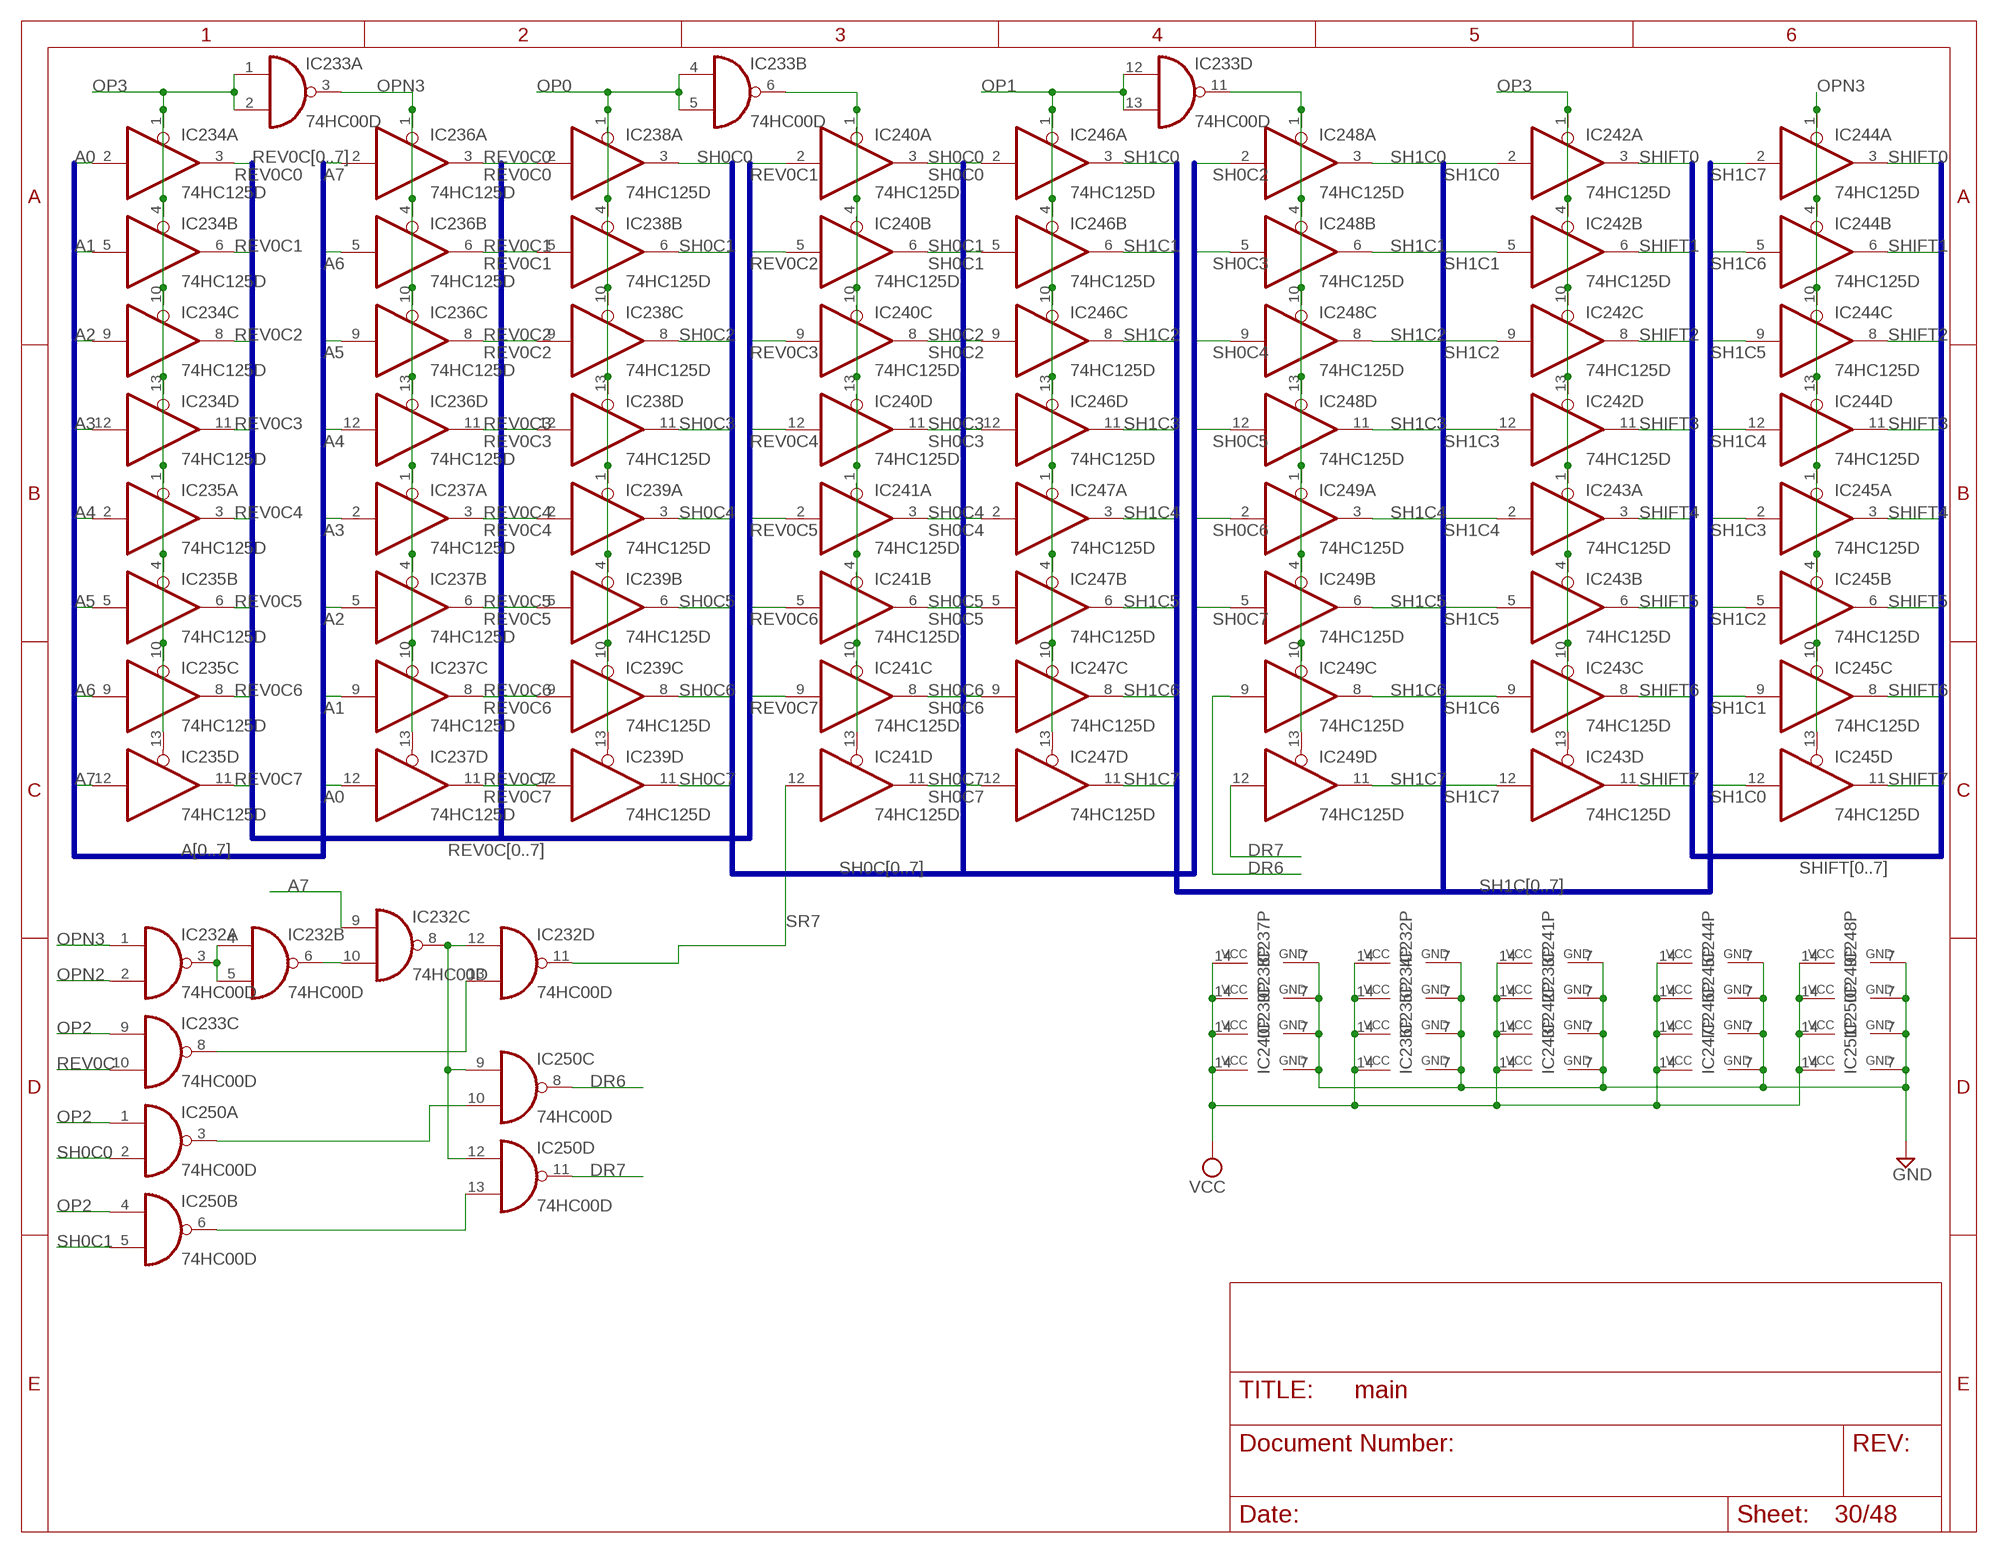
[diagram p29: schematic, sheet 30]

### Parts
IC232  74HC00D  [SO14]
IC233  74HC00D  [SO14]
IC234  74HC125D  [SO14]
IC235  74HC125D  [SO14]
IC236  74HC125D  [SO14]
IC237  74HC125D  [SO14]
IC238  74HC125D  [SO14]
IC239  74HC125D  [SO14]
IC240  74HC125D  [SO14]
IC241  74HC125D  [SO14]
IC242  74HC125D  [SO14]
IC243  74HC125D  [SO14]
IC244  74HC125D  [SO14]
IC245  74HC125D  [SO14]
IC246  74HC125D  [SO14]
IC247  74HC125D  [SO14]
IC248  74HC125D  [SO14]
IC249  74HC125D  [SO14]
IC250  74HC00D  [SO14]
IC251  74HC00D  [SO14]

### Nets
A0: IC234.2(A:I) IC237.12(D:I) ; also sheet 1,3,4,11,24,25,26,34,41
A1: IC234.5(B:I) IC237.9(C:I) ; also sheet 1,3,4,11,19,24,25,26,34,41
A2: IC234.9(C:I) IC237.5(B:I) ; also sheet 1,24,25,26,34,41
A3: IC234.12(D:I) IC237.2(A:I) ; also sheet 1,2,5,6,11,22,24,25,26,34,41
A4: IC235.2(A:I) IC236.12(D:I) ; also sheet 2,24,25,27,34,40
A5: IC235.5(B:I) IC236.9(C:I) ; also sheet 2,7,8,11,16,24,25,27,34,40
A6: IC235.9(C:I) IC236.5(B:I) ; also sheet 2,24,25,27,34,40
A7: IC232.9(C:I0) IC235.12(D:I) IC236.2(A:I) ; also sheet 2,9,10,11,15,24,25,27,34,40
DR6: IC249.9(C:I) IC250.8(C:O)
DR7: IC249.12(D:I) IC250.11(D:O)
GND: IC232.7(P:GND) IC233.7(P:GND) IC234.7(P:GND) IC235.7(P:GND) IC236.7(P:GND) IC237.7(P:GND) IC238.7(P:GND) IC239.7(P:GND) IC240.7(P:GND) IC241.7(P:GND) IC242.7(P:GND) IC243.7(P:GND) IC244.7(P:GND) IC245.7(P:GND) IC246.7(P:GND) IC247.7(P:GND) IC248.7(P:GND) IC249.7(P:GND) IC250.7(P:GND) IC251.7(P:GND) ; also sheet 1,2,3,4,5,6,7,8,9,10,11,12,13,14,15,16,17,18,19,20,21,22,23,24,25,26,27,28,29,31,32,33,34,37,38,39,40,41,42,43,44,45,46,47
N$572: IC232.3(A:O) IC232.4(B:I0) IC232.5(B:I1)
N$618: IC232.6(B:O) IC232.10(C:I1)
N$965: IC250.6(B:O) IC250.13(D:I1)
N$981: IC232.8(C:O) IC232.12(D:I0) IC250.9(C:I0) IC250.12(D:I0)
N$982: IC250.3(A:O) IC250.10(C:I1)
N$983: IC232.13(D:I1) IC233.8(C:O)
OP0: IC233.4(B:I0) IC233.5(B:I1) IC238.1(A:OE) IC238.4(B:OE) IC238.10(C:OE) IC238.13(D:OE) IC239.1(A:OE) IC239.4(B:OE) IC239.10(C:OE) IC239.13(D:OE) ; also sheet 29,39,45,46,47
OP1: IC233.12(D:I0) IC233.13(D:I1) IC246.1(A:OE) IC246.4(B:OE) IC246.10(C:OE) IC246.13(D:OE) IC247.1(A:OE) IC247.4(B:OE) IC247.10(C:OE) IC247.13(D:OE) ; also sheet 29,39,45,46,47
OP2: IC233.9(C:I0) IC250.1(A:I0) IC250.4(B:I0) ; also sheet 29,37,39,45,46,47
OP3: IC233.1(A:I0) IC233.2(A:I1) IC234.1(A:OE) IC234.4(B:OE) IC234.10(C:OE) IC234.13(D:OE) IC235.1(A:OE) IC235.4(B:OE) IC235.10(C:OE) IC235.13(D:OE) IC242.1(A:OE) IC242.4(B:OE) IC242.10(C:OE) IC242.13(D:OE) IC243.1(A:OE) IC243.4(B:OE) IC243.10(C:OE) IC243.13(D:OE) ; also sheet 29,39,45,47
OPN0: IC233.6(B:O) IC240.1(A:OE) IC240.4(B:OE) IC240.10(C:OE) IC240.13(D:OE) IC241.1(A:OE) IC241.4(B:OE) IC241.10(C:OE) IC241.13(D:OE) ; also sheet 39,46
OPN1: IC233.11(D:O) IC248.1(A:OE) IC248.4(B:OE) IC248.10(C:OE) IC248.13(D:OE) IC249.1(A:OE) IC249.4(B:OE) IC249.10(C:OE) IC249.13(D:OE) ; also sheet 39,46
OPN2: IC232.2(A:I1) ; also sheet 37,39,46
OPN3: IC232.1(A:I0) IC233.3(A:O) IC236.1(A:OE) IC236.4(B:OE) IC236.10(C:OE) IC236.13(D:OE) IC237.1(A:OE) IC237.4(B:OE) IC237.10(C:OE) IC237.13(D:OE) IC244.1(A:OE) IC244.4(B:OE) IC244.10(C:OE) IC244.13(D:OE) IC245.1(A:OE) IC245.4(B:OE) IC245.10(C:OE) IC245.13(D:OE) ; also sheet 39
REV0C: IC233.10(C:I1)
REV0C0: IC234.3(A:O) IC236.3(A:O) IC238.2(A:I)
REV0C1: IC234.6(B:O) IC236.6(B:O) IC238.5(B:I) IC240.2(A:I)
REV0C2: IC234.8(C:O) IC236.8(C:O) IC238.9(C:I) IC240.5(B:I)
REV0C3: IC234.11(D:O) IC236.11(D:O) IC238.12(D:I) IC240.9(C:I)
REV0C4: IC235.3(A:O) IC237.3(A:O) IC239.2(A:I) IC240.12(D:I)
REV0C5: IC235.6(B:O) IC237.6(B:O) IC239.5(B:I) IC241.2(A:I)
REV0C6: IC235.8(C:O) IC237.8(C:O) IC239.9(C:I) IC241.5(B:I)
REV0C7: IC235.11(D:O) IC237.11(D:O) IC239.12(D:I) IC241.9(C:I)
SH0C0: IC238.3(A:O) IC240.3(A:O) IC246.2(A:I) IC250.2(A:I1)
SH0C1: IC238.6(B:O) IC240.6(B:O) IC246.5(B:I) IC250.5(B:I1)
SH0C2: IC238.8(C:O) IC240.8(C:O) IC246.9(C:I) IC248.2(A:I)
SH0C3: IC238.11(D:O) IC240.11(D:O) IC246.12(D:I) IC248.5(B:I)
SH0C4: IC239.3(A:O) IC241.3(A:O) IC247.2(A:I) IC248.9(C:I)
SH0C5: IC239.6(B:O) IC241.6(B:O) IC247.5(B:I) IC248.12(D:I)
SH0C6: IC239.8(C:O) IC241.8(C:O) IC247.9(C:I) IC249.2(A:I)
SH0C7: IC239.11(D:O) IC241.11(D:O) IC247.12(D:I) IC249.5(B:I)
SH1C0: IC242.2(A:I) IC245.12(D:I) IC246.3(A:O) IC248.3(A:O)
SH1C1: IC242.5(B:I) IC245.9(C:I) IC246.6(B:O) IC248.6(B:O)
SH1C2: IC242.9(C:I) IC245.5(B:I) IC246.8(C:O) IC248.8(C:O)
SH1C3: IC242.12(D:I) IC245.2(A:I) IC246.11(D:O) IC248.11(D:O)
SH1C4: IC243.2(A:I) IC244.12(D:I) IC247.3(A:O) IC249.3(A:O)
SH1C5: IC243.5(B:I) IC244.9(C:I) IC247.6(B:O) IC249.6(B:O)
SH1C6: IC243.9(C:I) IC244.5(B:I) IC247.8(C:O) IC249.8(C:O)
SH1C7: IC243.12(D:I) IC244.2(A:I) IC247.11(D:O) IC249.11(D:O)
SHIFT0: IC242.3(A:O) IC244.3(A:O) ; also sheet 45
SHIFT1: IC242.6(B:O) IC244.6(B:O) ; also sheet 45
SHIFT2: IC242.8(C:O) IC244.8(C:O) ; also sheet 45
SHIFT3: IC242.11(D:O) IC244.11(D:O) ; also sheet 45
SHIFT4: IC243.3(A:O) IC245.3(A:O) ; also sheet 44
SHIFT5: IC243.6(B:O) IC245.6(B:O) ; also sheet 44
SHIFT6: IC243.8(C:O) IC245.8(C:O) ; also sheet 44
SHIFT7: IC243.11(D:O) IC245.11(D:O) ; also sheet 44
SR7: IC232.11(D:O) IC241.12(D:I)
VCC: IC232.14(P:VCC) IC233.14(P:VCC) IC234.14(P:VCC) IC235.14(P:VCC) IC236.14(P:VCC) IC237.14(P:VCC) IC238.14(P:VCC) IC239.14(P:VCC) IC240.14(P:VCC) IC241.14(P:VCC) IC242.14(P:VCC) IC243.14(P:VCC) IC244.14(P:VCC) IC245.14(P:VCC) IC246.14(P:VCC) IC247.14(P:VCC) IC248.14(P:VCC) IC249.14(P:VCC) IC250.14(P:VCC) IC251.14(P:VCC) ; also sheet 1,2,3,4,5,6,7,8,9,10,11,12,13,14,15,16,17,18,19,20,21,22,23,24,25,26,27,28,29,31,32,33,34,37,38,39,40,41,42,43,44,45,46,47
Unconnected: IC251.1(A:I0) IC251.2(A:I1) IC251.3(A:O) IC251.4(B:I0) IC251.5(B:I1) IC251.6(B:O) IC251.8(C:O) IC251.9(C:I0) IC251.10(C:I1) IC251.11(D:O) IC251.12(D:I0) IC251.13(D:I1)

### Buses
A[0..7]
REV0C[0..7]
SH0C[0..7]
SH1C[0..7]
SHIFT[0..7]

## Sheet 31 of 48: PC_ADDER 0-7
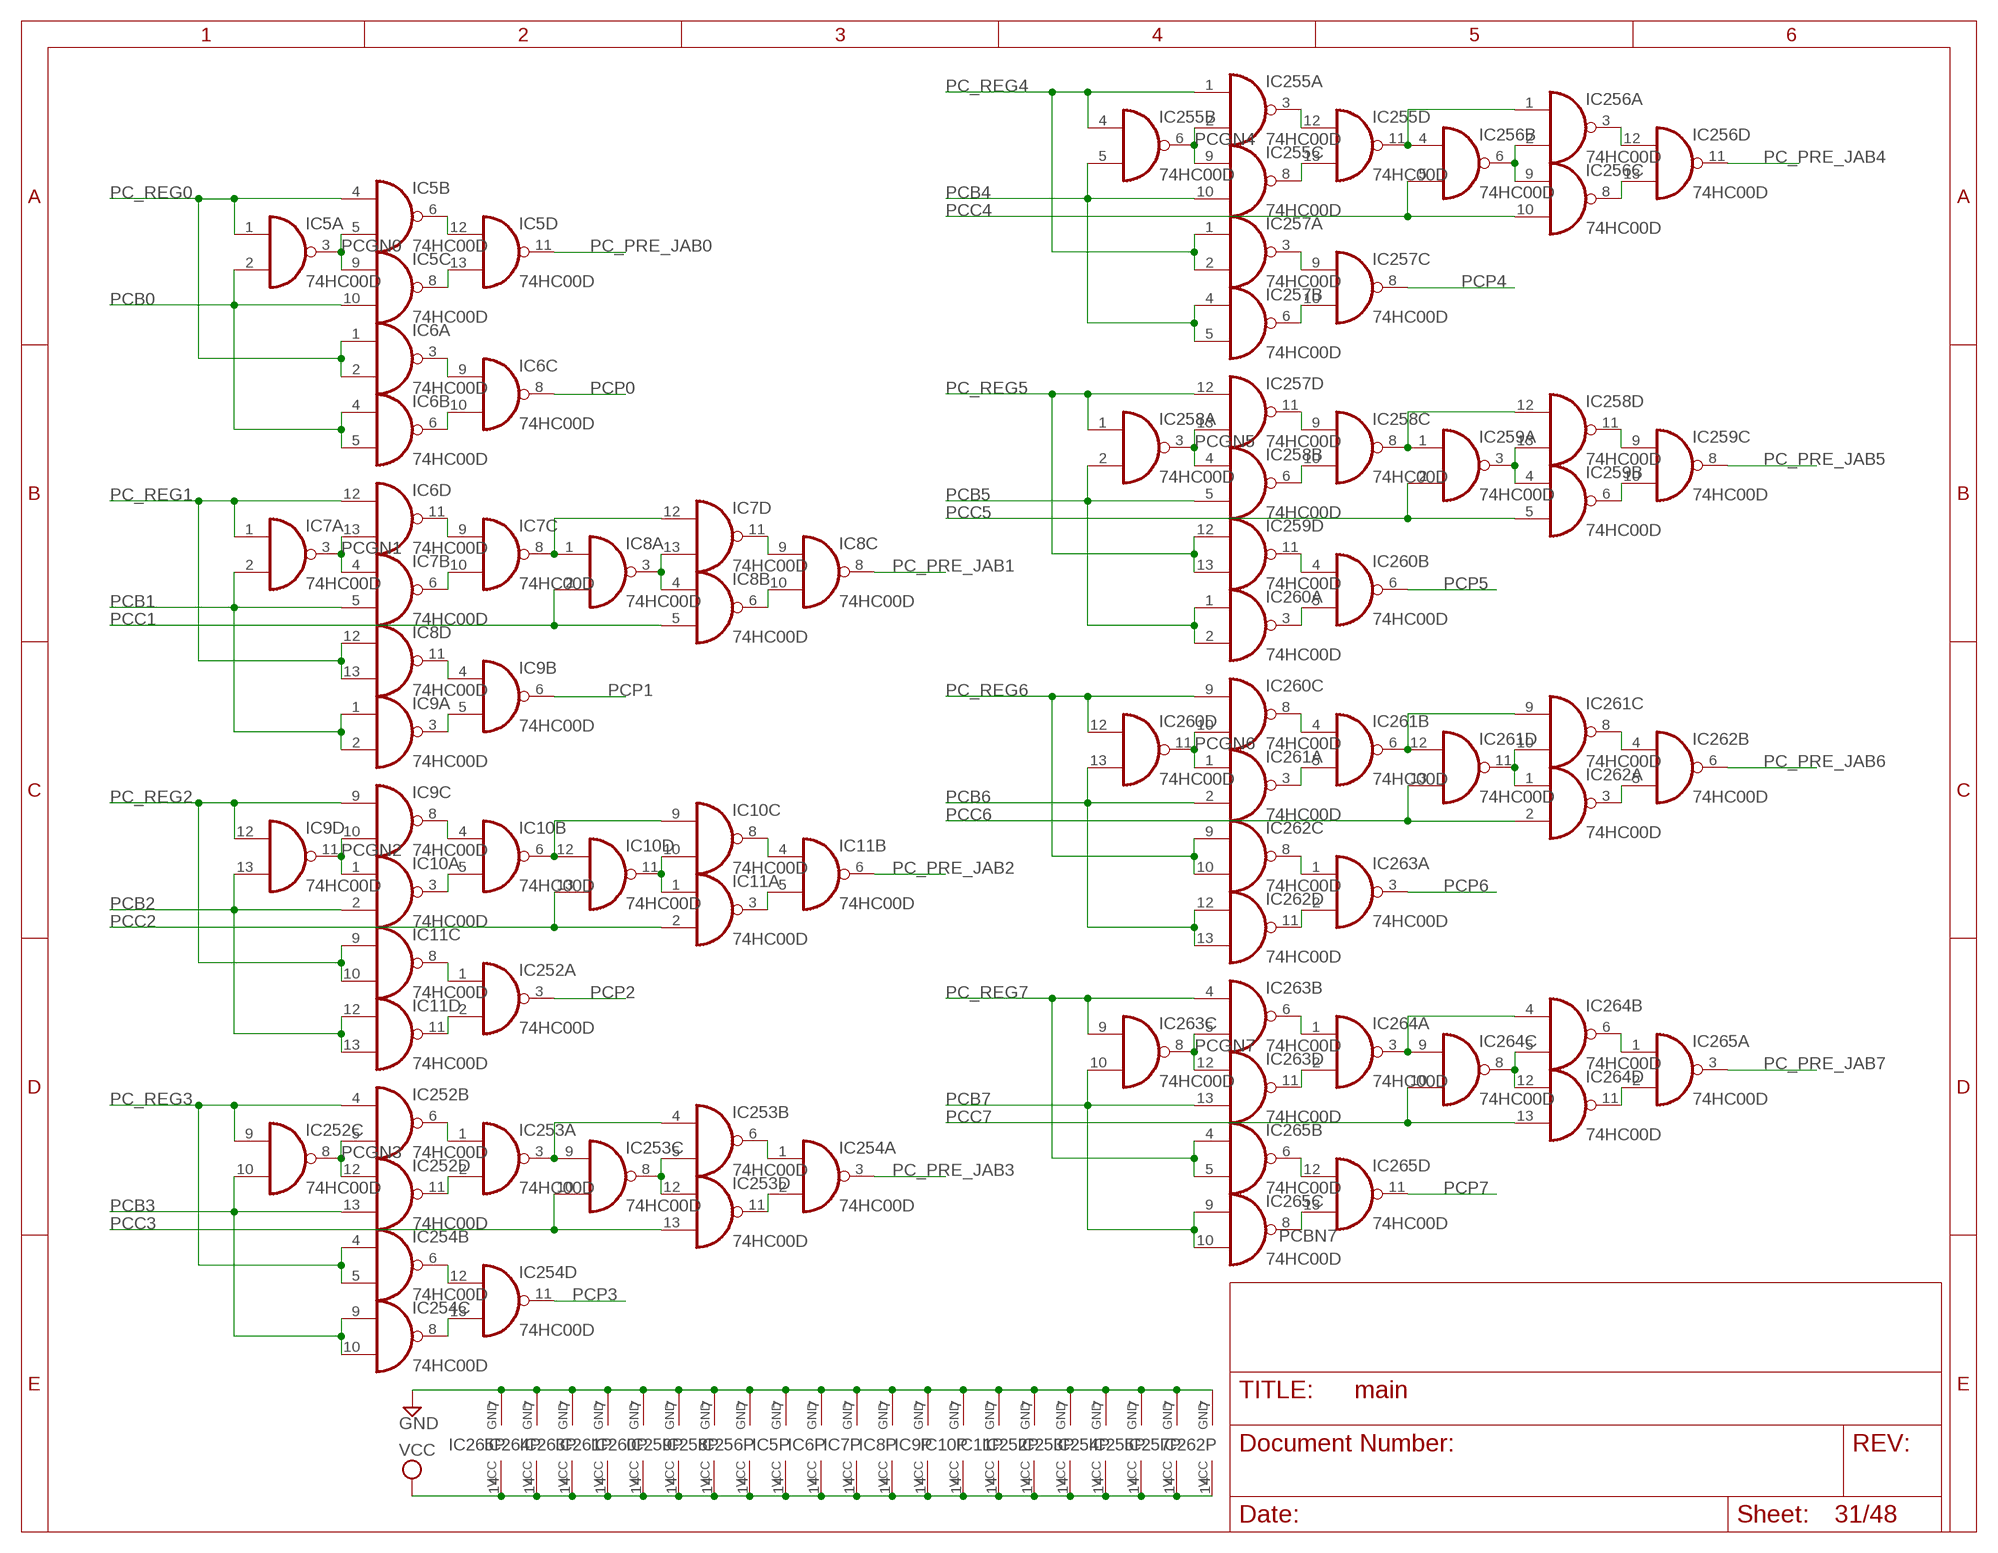
[diagram p30: schematic, sheet 31]

### Parts
IC5  74HC00D  [SO14]
IC6  74HC00D  [SO14]
IC7  74HC00D  [SO14]
IC8  74HC00D  [SO14]
IC9  74HC00D  [SO14]
IC10  74HC00D  [SO14]
IC11  74HC00D  [SO14]
IC252  74HC00D  [SO14]
IC253  74HC00D  [SO14]
IC254  74HC00D  [SO14]
IC255  74HC00D  [SO14]
IC256  74HC00D  [SO14]
IC257  74HC00D  [SO14]
IC258  74HC00D  [SO14]
IC259  74HC00D  [SO14]
IC260  74HC00D  [SO14]
IC261  74HC00D  [SO14]
IC262  74HC00D  [SO14]
IC263  74HC00D  [SO14]
IC264  74HC00D  [SO14]
IC265  74HC00D  [SO14]

### Nets
GND: IC5.7(P:GND) IC6.7(P:GND) IC7.7(P:GND) IC8.7(P:GND) IC9.7(P:GND) IC10.7(P:GND) IC11.7(P:GND) IC252.7(P:GND) IC253.7(P:GND) IC254.7(P:GND) IC255.7(P:GND) IC256.7(P:GND) IC257.7(P:GND) IC258.7(P:GND) IC259.7(P:GND) IC260.7(P:GND) IC261.7(P:GND) IC262.7(P:GND) IC263.7(P:GND) IC264.7(P:GND) IC265.7(P:GND) ; also sheet 1,2,3,4,5,6,7,8,9,10,11,12,13,14,15,16,17,18,19,20,21,22,23,24,25,26,27,28,29,30,32,33,34,37,38,39,40,41,42,43,44,45,46,47
N$692: IC7.8(C:O) IC7.12(D:I0) IC8.1(A:I0)
N$693: IC10.6(B:O) IC10.9(C:I0) IC10.12(D:I0)
N$694: IC253.3(A:O) IC253.4(B:I0) IC253.9(C:I0)
N$695: IC6.6(B:O) IC6.10(C:I1)
N$696: IC6.3(A:O) IC6.9(C:I0)
N$697: IC5.8(C:O) IC5.13(D:I1)
N$698: IC5.6(B:O) IC5.12(D:I0)
N$704: IC255.11(D:O) IC256.1(A:I0) IC256.4(B:I0)
N$705: IC258.8(C:O) IC258.12(D:I0) IC259.1(A:I0)
N$709: IC261.6(B:O) IC261.9(C:I0) IC261.12(D:I0)
N$720: IC264.3(A:O) IC264.4(B:I0) IC264.9(C:I0)
N$721: IC7.6(B:O) IC7.10(C:I1)
N$722: IC6.11(D:O) IC7.9(C:I0)
N$723: IC8.11(D:O) IC9.4(B:I0)
N$724: IC9.3(A:O) IC9.5(B:I1)
N$725: IC7.13(D:I1) IC8.3(A:O) IC8.4(B:I0)
N$727: IC7.11(D:O) IC8.9(C:I0)
N$728: IC8.6(B:O) IC8.10(C:I1)
N$742: IC10.3(A:O) IC10.5(B:I1)
N$743: IC9.8(C:O) IC10.4(B:I0)
N$744: IC11.8(C:O) IC252.1(A:I0)
N$745: IC11.11(D:O) IC252.2(A:I1)
N$747: IC10.10(C:I1) IC10.11(D:O) IC11.1(A:I0)
N$748: IC11.3(A:O) IC11.5(B:I1)
N$749: IC10.8(C:O) IC11.4(B:I0)
N$752: IC253.6(B:O) IC254.1(A:I0)
N$753: IC253.11(D:O) IC254.2(A:I1)
N$754: IC253.5(B:I1) IC253.8(C:O) IC253.12(D:I0)
N$756: IC252.6(B:O) IC253.1(A:I0)
N$757: IC252.11(D:O) IC253.2(A:I1)
N$759: IC258.6(B:O) IC258.10(C:I1)
N$760: IC257.11(D:O) IC258.9(C:I0)
N$763: IC254.6(B:O) IC254.12(D:I0)
N$764: IC254.8(C:O) IC254.13(D:I1)
N$766: IC256.8(C:O) IC256.13(D:I1)
N$767: IC256.3(A:O) IC256.12(D:I0)
N$768: IC256.2(A:I1) IC256.6(B:O) IC256.9(C:I0)
N$772: IC257.6(B:O) IC257.10(C:I1)
N$773: IC257.3(A:O) IC257.9(C:I0)
N$776: IC255.8(C:O) IC255.13(D:I1)
N$777: IC255.3(A:O) IC255.12(D:I0)
N$778: IC258.13(D:I1) IC259.3(A:O) IC259.4(B:I0)
N$779: IC258.11(D:O) IC259.9(C:I0)
N$780: IC259.6(B:O) IC259.10(C:I1)
N$782: IC264.5(B:I1) IC264.8(C:O) IC264.12(D:I0)
N$786: IC260.3(A:O) IC260.5(B:I1)
N$787: IC259.11(D:O) IC260.4(B:I0)
N$789: IC261.3(A:O) IC261.5(B:I1)
N$790: IC260.8(C:O) IC261.4(B:I0)
N$792: IC261.10(C:I1) IC261.11(D:O) IC262.1(A:I0)
N$793: IC261.8(C:O) IC262.4(B:I0)
N$794: IC262.3(A:O) IC262.5(B:I1)
N$795: IC264.11(D:O) IC265.2(A:I1)
N$796: IC264.6(B:O) IC265.1(A:I0)
N$800: IC262.11(D:O) IC263.2(A:I1)
N$801: IC262.8(C:O) IC263.1(A:I0)
N$804: IC265.6(B:O) IC265.12(D:I0)
N$814: IC263.6(B:O) IC264.1(A:I0)
N$815: IC263.11(D:O) IC264.2(A:I1)
PC_PRE_JAB0: IC5.11(D:O) ; also sheet 34
PC_PRE_JAB1: IC8.8(C:O) ; also sheet 34
PC_PRE_JAB2: IC11.6(B:O) ; also sheet 34
PC_PRE_JAB3: IC254.3(A:O) ; also sheet 34
PC_PRE_JAB4: IC256.11(D:O) ; also sheet 34
PC_PRE_JAB5: IC259.8(C:O) ; also sheet 34
PC_PRE_JAB6: IC262.6(B:O) ; also sheet 34
PC_PRE_JAB7: IC265.3(A:O) ; also sheet 34
PC_REG0: IC5.1(A:I0) IC5.4(B:I0) IC6.1(A:I0) IC6.2(A:I1) ; also sheet 47
PC_REG1: IC6.12(D:I0) IC7.1(A:I0) IC8.12(D:I0) IC8.13(D:I1) ; also sheet 47
PC_REG2: IC9.9(C:I0) IC9.12(D:I0) IC11.9(C:I0) IC11.10(C:I1) ; also sheet 47
PC_REG3: IC252.4(B:I0) IC252.9(C:I0) IC254.4(B:I0) IC254.5(B:I1) ; also sheet 47
PC_REG4: IC255.1(A:I0) IC255.4(B:I0) IC257.1(A:I0) IC257.2(A:I1) ; also sheet 47
PC_REG5: IC257.12(D:I0) IC258.1(A:I0) IC259.12(D:I0) IC259.13(D:I1) ; also sheet 47
PC_REG6: IC260.9(C:I0) IC260.12(D:I0) IC262.9(C:I0) IC262.10(C:I1) ; also sheet 47
PC_REG7: IC263.4(B:I0) IC263.9(C:I0) IC265.4(B:I0) IC265.5(B:I1) ; also sheet 47
PCB0: IC5.2(A:I1) IC5.10(C:I1) IC6.4(B:I0) IC6.5(B:I1) ; also sheet 29
PCB1: IC7.2(A:I1) IC7.5(B:I1) IC9.1(A:I0) IC9.2(A:I1) ; also sheet 29
PCB2: IC9.13(D:I1) IC10.2(A:I1) IC11.12(D:I0) IC11.13(D:I1) ; also sheet 29
PCB3: IC252.10(C:I1) IC252.13(D:I1) IC254.9(C:I0) IC254.10(C:I1) ; also sheet 29
PCB4: IC255.5(B:I1) IC255.10(C:I1) IC257.4(B:I0) IC257.5(B:I1) ; also sheet 29
PCB5: IC258.2(A:I1) IC258.5(B:I1) IC260.1(A:I0) IC260.2(A:I1) ; also sheet 29
PCB6: IC260.13(D:I1) IC261.2(A:I1) IC262.12(D:I0) IC262.13(D:I1) ; also sheet 29
PCB7: IC263.10(C:I1) IC263.13(D:I1) IC265.9(C:I0) IC265.10(C:I1) ; also sheet 29,32
PCBN7: IC265.8(C:O) IC265.13(D:I1) ; also sheet 32
PCC1: IC8.2(A:I1) IC8.5(B:I1) ; also sheet 12,29
PCC2: IC10.13(D:I1) IC11.2(A:I1) ; also sheet 29,32
PCC3: IC253.10(C:I1) IC253.13(D:I1) ; also sheet 32,33
PCC4: IC256.5(B:I1) IC256.10(C:I1) ; also sheet 33
PCC5: IC259.2(A:I1) IC259.5(B:I1) ; also sheet 33
PCC6: IC261.13(D:I1) IC262.2(A:I1) ; also sheet 33
PCC7: IC264.10(C:I1) IC264.13(D:I1) ; also sheet 33
PCGN0: IC5.3(A:O) IC5.5(B:I1) IC5.9(C:I0) ; also sheet 12
PCGN1: IC6.13(D:I1) IC7.3(A:O) IC7.4(B:I0) ; also sheet 29
PCGN2: IC9.10(C:I1) IC9.11(D:O) IC10.1(A:I0) ; also sheet 32
PCGN3: IC252.5(B:I1) IC252.8(C:O) IC252.12(D:I0) ; also sheet 33
PCGN4: IC255.2(A:I1) IC255.6(B:O) IC255.9(C:I0) ; also sheet 33
PCGN5: IC257.13(D:I1) IC258.3(A:O) IC258.4(B:I0) ; also sheet 33
PCGN6: IC260.10(C:I1) IC260.11(D:O) IC261.1(A:I0) ; also sheet 33
PCGN7: IC263.5(B:I1) IC263.8(C:O) IC263.12(D:I0) ; also sheet 33
PCP0: IC6.8(C:O)
PCP1: IC9.6(B:O) ; also sheet 29
PCP2: IC252.3(A:O) ; also sheet 32
PCP3: IC254.11(D:O) ; also sheet 33
PCP4: IC257.8(C:O) ; also sheet 33
PCP5: IC260.6(B:O) ; also sheet 33
PCP6: IC263.3(A:O) ; also sheet 33
PCP7: IC265.11(D:O) ; also sheet 33
VCC: IC5.14(P:VCC) IC6.14(P:VCC) IC7.14(P:VCC) IC8.14(P:VCC) IC9.14(P:VCC) IC10.14(P:VCC) IC11.14(P:VCC) IC252.14(P:VCC) IC253.14(P:VCC) IC254.14(P:VCC) IC255.14(P:VCC) IC256.14(P:VCC) IC257.14(P:VCC) IC258.14(P:VCC) IC259.14(P:VCC) IC260.14(P:VCC) IC261.14(P:VCC) IC262.14(P:VCC) IC263.14(P:VCC) IC264.14(P:VCC) IC265.14(P:VCC) ; also sheet 1,2,3,4,5,6,7,8,9,10,11,12,13,14,15,16,17,18,19,20,21,22,23,24,25,26,27,28,29,30,32,33,34,37,38,39,40,41,42,43,44,45,46,47